# Altium project VESC_BMS.PrjPcb (part 1 of 2)
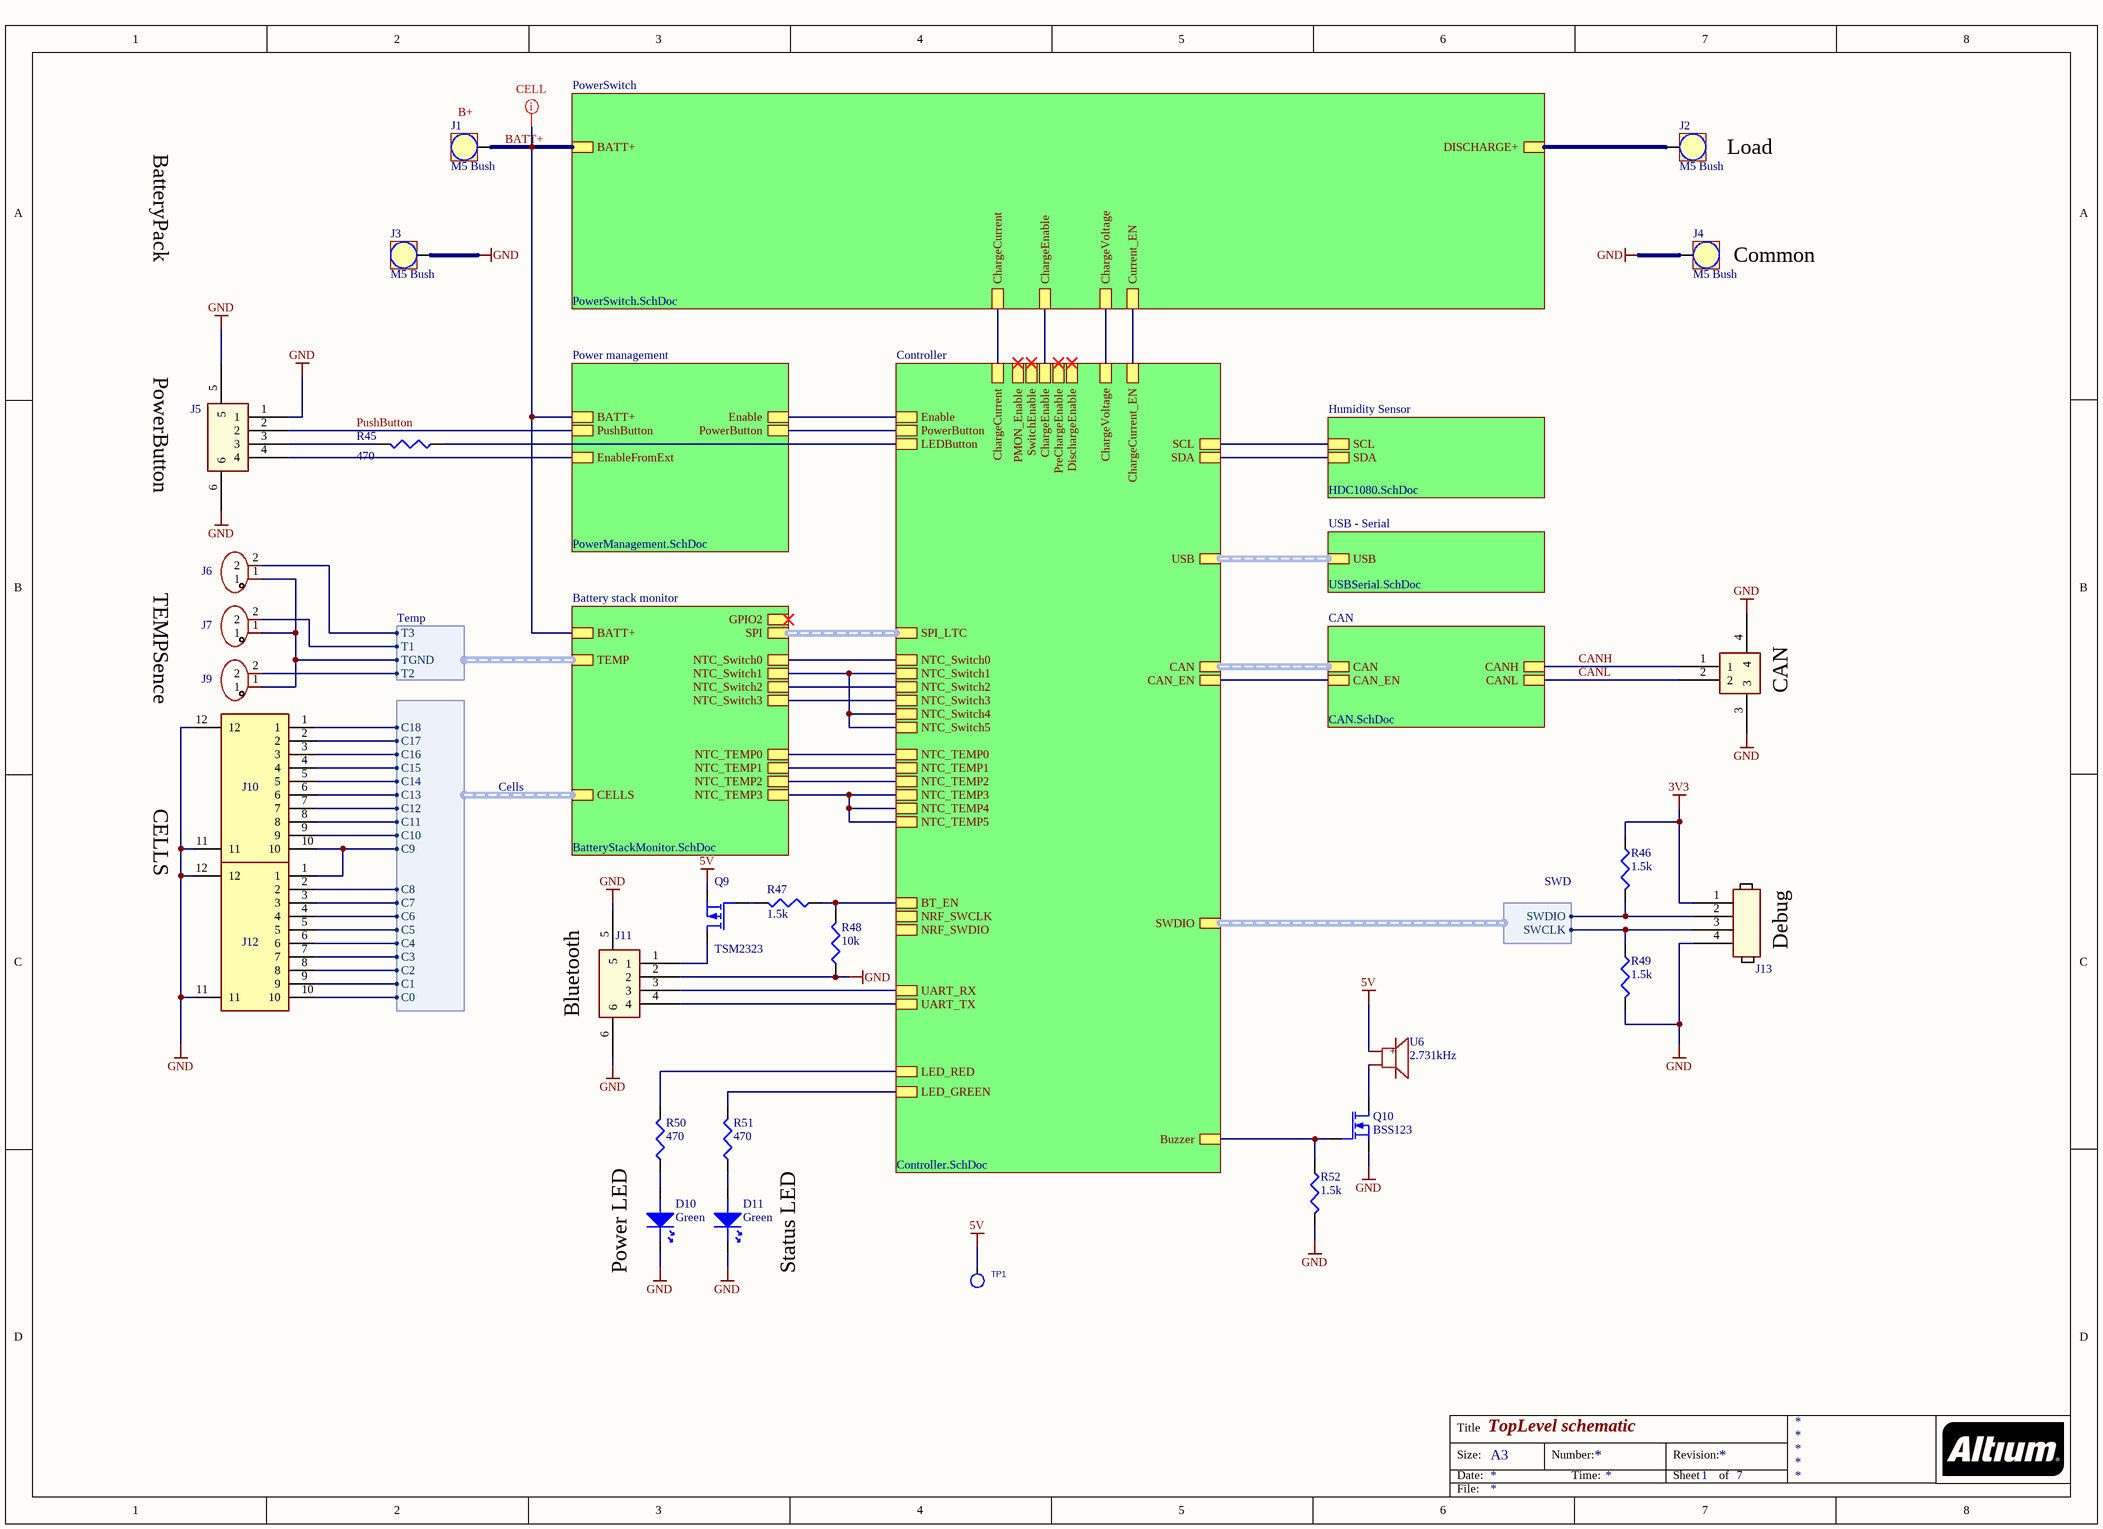
[diagram p0: BMS_TopLevel.SchDoc]
9 sheets, 263 parts. Net scope: hierarchical (ports join the sheet entries above them; power ports are global).
Board file: VESC_BMS.PcbDoc
Sheets:
  BMS_TopLevel.SchDoc
    Battery stack monitor = BatteryStackMonitor.SchDoc
      CELL1 = BMS_CellNode.SchDoc
      CELL2 = BMS_CellNode.SchDoc
      CELL3 = BMS_CellNode.SchDoc
      CELL4 = BMS_CellNode.SchDoc
      CELL5 = BMS_CellNode.SchDoc
      CELL6 = BMS_CellNode.SchDoc
      CELL7 = BMS_CellNode.SchDoc
      CELL8 = BMS_CellNode.SchDoc
      CELL9 = BMS_CellNode.SchDoc
      CELL10 = BMS_CellNode.SchDoc
      CELL11 = BMS_CellNode.SchDoc
      CELL12 = BMS_CellNode.SchDoc
      CELL13 = BMS_CellNode.SchDoc
      CELL14 = BMS_CellNode.SchDoc
      CELL15 = BMS_CellNode.SchDoc
      CELL16 = BMS_CellNode.SchDoc
      CELL17 = BMS_CellNode.SchDoc
      CELL18 = BMS_CellNode.SchDoc
    Controller = Controller.SchDoc
    PowerSwitch = PowerSwitch.SchDoc
    Power management = PowerManagement.SchDoc
    CAN = CAN.SchDoc
    USB - Serial = USBSerial.SchDoc
    Humidity Sensor = HDC1080.SchDoc

## Sheet BMS_TopLevel.SchDoc: TopLevel schematic
size A3; SheetNumber: 1; SheetTotal: 7

### Parts
D10  Green  [LED0603]
D11  Green  [LED0603]
J1  M5 Bush  [CONN-TH_T44001]
J2  M5 Bush  [CONN-TH_T44001]
J3  M5 Bush  [CONN-TH_T44001]
J4  M5 Bush  [CONN-TH_T44001]
J5  1.25-4PWTDK  [SM04B-GHS-TB]  (value not drawn)
J6  WAFER-XH254Z-2A  [CONN-TH_2P-P2.50_XH-2AW]  (value not drawn)
J7  WAFER-XH254Z-2A  [CONN-TH_2P-P2.50_XH-2AW]  (value not drawn)
J8  1.25-2PWTDK  [BM02B-GHS-TBT_1]  (value not drawn)
J9  WAFER-XH254Z-2A  [CONN-TH_2P-P2.50_XH-2AW]  (value not drawn)
J10  S10B-PH-SM4-TB_LF__SN_  [S10B-PH-SM4-TB]  (value not drawn)
J11  1.25-4PWTDK  [SM04B-GHS-TB]  (value not drawn)
J12  S10B-PH-SM4-TB_LF__SN_  [S10B-PH-SM4-TB]  (value not drawn)
J13  4 HEADER  [PZ-4P-2_54]  (value not drawn)
Q9  TSM2323  [SOT-23]
Q10  BSS123  [SOT-23]
R45  470  [0402]
R46  1.5k  [0402]
R47  1.5k  [0402]
R48  10k  [0402]
R49  1.5k  [0402]
R50  470  [0402]
R51  470  [0402]
R52  1.5k  [0402]
TP1  1.3TP  [TP2-1.3MM]  (value not drawn)  (no BOM)
U6  2.731kHz  [BUZ-SMD_4P-L7.5-W7.5-BR]

### Sub-sheets
Battery stack monitor = BatteryStackMonitor.SchDoc: SPI (harness SPI), CELLS (harness Cells), TEMP (harness Temp), BATT+, NTC_Switch0, NTC_Switch1, NTC_Switch2, NTC_Switch3, NTC_TEMP2, NTC_TEMP3, NTC_TEMP0, NTC_TEMP1, GPIO2
CAN = CAN.SchDoc: CANH, CAN (harness CAN), CANL, CAN_EN
Controller = Controller.SchDoc: SPI_LTC (harness SPI), DischargeEnable, ChargeEnable, SwitchEnable, PreChargeEnable, CAN (harness CAN), SWDIO (harness SWD), Buzzer, PMON_Enable, CAN_EN, ChargeCurrent, ChargeVoltage, NTC_Switch0, NTC_Switch1, NTC_Switch2, NTC_Switch3, NTC_Switch4, NTC_Switch5, NTC_TEMP0, NTC_TEMP1, NTC_TEMP2, NTC_TEMP3, NTC_TEMP4, NTC_TEMP5, ChargeCurrent_EN, USB (harness USB), LED_RED, LED_GREEN, UART_TX, UART_RX, NRF_SWCLK, NRF_SWDIO, Enable, PowerButton, LEDButton, SCL, SDA, BT_EN
Humidity Sensor = HDC1080.SchDoc: SCL, SDA
Power management = PowerManagement.SchDoc: PushButton, BATT+, Enable, PowerButton, EnableFromExt
PowerSwitch = PowerSwitch.SchDoc: ChargeEnable, DISCHARGE+, BATT+, ChargeCurrent, ChargeVoltage, Current_EN
USB - Serial = USBSerial.SchDoc: USB (harness USB)

### Harnesses
Cells: C1, C9, C2, C3, C4, C5, C6, C7, C8, C10, C11, C0, C12, C13, C14, C15, C16, C17, C18
Temp: T1, T2, TGND, T3
SWD: SWCLK, SWDIO

### Nets
3V3: J13.1 R46.1
5V: Q9.S TP1.1(TP) U6.1(+)
GND: D10.1 D11.1 J3.1 J4.1 J5.1 J5.5 J5.6 J6.1 J7.1 J8.3 J8.4 J9.1 J10.11 J10.12 J11.2 J11.5 J11.6 J12.11 J12.12 J13.4 Q10.S R48.1 R49.2 R52.2 ; sheet Battery stack monitor/TEMP.TGND
BATT+: J1.1 ; sheet Battery stack monitor/BATT+, sheet PowerSwitch/BATT+, sheet Power management/BATT+
BT_EN: R47.1 R48.2 ; sheet Controller/BT_EN
Buzzer: Q10.G R52.1 ; sheet Controller/Buzzer
CANH: J8.1 ; sheet CAN/CANH
CANL: J8.2 ; sheet CAN/CANL
ChargeEnable: sheet Controller/ChargeEnable, sheet PowerSwitch/ChargeEnable
CN1: J12.10 ; sheet Battery stack monitor/CELLS.C0
CN2: J12.9 ; sheet Battery stack monitor/CELLS.C1
CN3: J12.8 ; sheet Battery stack monitor/CELLS.C2
CN4: J12.7 ; sheet Battery stack monitor/CELLS.C3
CN5: J12.6 ; sheet Battery stack monitor/CELLS.C4
CN6: J12.5 ; sheet Battery stack monitor/CELLS.C5
CN7: J12.4 ; sheet Battery stack monitor/CELLS.C6
CN8: J12.3 ; sheet Battery stack monitor/CELLS.C7
CN9: J12.2 ; sheet Battery stack monitor/CELLS.C8
CN10: J10.10 J12.1 ; sheet Battery stack monitor/CELLS.C9
CN11: J10.9 ; sheet Battery stack monitor/CELLS.C10
CN12: J10.8 ; sheet Battery stack monitor/CELLS.C11
CN13: J10.7 ; sheet Battery stack monitor/CELLS.C12
CN14: J10.6 ; sheet Battery stack monitor/CELLS.C13
CN15: J10.5 ; sheet Battery stack monitor/CELLS.C14
CN16: J10.4 ; sheet Battery stack monitor/CELLS.C15
CN17: J10.3 ; sheet Battery stack monitor/CELLS.C16
CN18: J10.2 ; sheet Battery stack monitor/CELLS.C17
CP18: J10.1 ; sheet Battery stack monitor/CELLS.C18
LED_GREEN: R51.2 ; sheet Controller/LED_GREEN
LED_RED: R50.2 ; sheet Controller/LED_RED
LoadOut: J2.1 ; sheet PowerSwitch/DISCHARGE+
PushButton: J5.2 ; sheet Power management/PushButton
SWCLK: J13.3 R49.1 ; sheet Controller/SWDIO.SWCLK
SWDIO: J13.2 R46.2 ; sheet Controller/SWDIO.SWDIO
NetC6_1: sheet Battery stack monitor/NTC_TEMP1, sheet Controller/NTC_TEMP1
NetC7_1: sheet Battery stack monitor/NTC_TEMP2, sheet Controller/NTC_TEMP2
NetC8_1: sheet Battery stack monitor/NTC_TEMP3, sheet Controller/NTC_TEMP3, sheet Controller/NTC_TEMP4, sheet Controller/NTC_TEMP5
NetC9_1: sheet Battery stack monitor/NTC_TEMP0, sheet Controller/NTC_TEMP0
NetC36_2: sheet Controller/ChargeVoltage, sheet PowerSwitch/ChargeVoltage
NetC37_2: sheet Controller/ChargeCurrent, sheet PowerSwitch/ChargeCurrent
NetD4_2: J5.4 ; sheet Power management/EnableFromExt
NetD10_2: D10.2 R50.1
NetD11_2: D11.2 R51.1
NetJ5_3: J5.3 R45.2
NetJ6_2: J6.2 ; sheet Battery stack monitor/TEMP.T3
NetJ7_2: J7.2 ; sheet Battery stack monitor/TEMP.T1
NetJ9_2: J9.2 ; sheet Battery stack monitor/TEMP.T2
NetJ11_1: J11.1 Q9.D
NetJ11_3: J11.3 ; sheet Controller/UART_RX
NetJ11_4: J11.4 ; sheet Controller/UART_TX
NetQ2_G: sheet Controller/Enable, sheet Power management/Enable
NetQ3_D: sheet Controller/PowerButton, sheet Power management/PowerButton
NetQ9_G: Q9.G R47.2
NetQ10_D: Q10.D U6.2
NetR8_2: sheet Battery stack monitor/NTC_Switch0, sheet Controller/NTC_Switch0
NetR10_2: sheet Battery stack monitor/NTC_Switch1, sheet Controller/NTC_Switch1, sheet Controller/NTC_Switch4, sheet Controller/NTC_Switch5
NetR12_2: sheet Battery stack monitor/NTC_Switch2, sheet Controller/NTC_Switch2
NetR14_2: sheet Battery stack monitor/NTC_Switch3, sheet Controller/NTC_Switch3
NetR42_2: sheet Controller/ChargeCurrent_EN, sheet PowerSwitch/Current_EN
NetR45_1: R45.1 ; sheet Controller/LEDButton
NetR61_1: sheet Controller/SDA, sheet Humidity Sensor/SDA
NetR62_1: sheet Controller/SCL, sheet Humidity Sensor/SCL
NetU2_56: sheet Controller/CAN_EN, sheet CAN/CAN_EN

Not connected (* = marked no-connect by the designer): U6 3 4

### Buses and harness runs
harness sheet Battery stack monitor/SPI = sheet Controller/SPI_LTC
harness sheet CAN/CAN = sheet Controller/CAN
harness sheet Controller/USB = sheet USB - Serial/USB

### Layout directives
net class CELL: BATT+

### Notes on the sheet
- BatteryPack
- (near J2) Load
- (near J4) Common
- (near J5) PowerButton
- TEMPSence
- (near J8) CAN
- CELLS
- (near J11) Bluetooth
- (near J13) Debug
- Power LED
- Status LED
- Labels drawn without touching a wire or pin: B+
- Title
- Size:
- Date:
- A3
- Number:
- Time:
- Revision:
- Sheet
- of
- File:

### Library data of the parts
D10 D11 = KP-2012SGC: Led, Green, Li:12mcd, Vf:2.2V, If:0.02A; Brand: KingBright; Case Style: 0805; Forward Current: 0.02A; Forward Voltage: 2.2V; Luminous Intensity: 12mcd; Brand Number: KP-2012SGC; Order Code Supplier: 1318243; Price: 0,06; Supplier: Farnell; Temperature Range: -30°C to +85°C
J1-J4 = T44001: Bush with Circumference M4; Brand: Wurth; Brand Number: 7460408; Case Style: M5Bush; Order Code Supplier: 1821279; Price: 4,17; Supplier: Farnell
J6 J7 J9 = WAFER-XH254Z-2A: Manufacturer: HANBO(汉博); Add into BOM: yes; Pins Structure: 1x2P; Pitch: 2.54mm; Reference Series: XH; Number of PINs Per Row: 2; Current Rating (Max): 3A; Symbol: WAFER-XH254Z-2A; Device: WAFER-XH254Z-2A; LCSC Part Name: WAFER-XH254Z-2A; Supplier Part: C7432682; Manufacturer Part: WAFER-XH254Z-2A; Supplier Footprint: 插件,P=2.5mm; Datasheet: https://atta.szlcsc.com/upload/public/pdf/source/20230718/3B4FABA5D38EFB02DAF74E7C2B33D98F.pdf; Supplier: LCSC; Convert to PCB: yes; Mounting Style: 直插; Number of Pins: 2P; Number of Rows: 1; Operating Temperature Range: -25℃~+85℃
J10 J12 = S10B-PH-SM4-TB_LF__SN_: Connector; Manufacturer_Name: JST (JAPAN SOLDERLESS TERMINALS); Manufacturer_Part_Number: S10B-PH-SM4-TB(LF)(SN); Datasheet Link: http://uk.rs-online.com/web/p/products/6881350; Mouser Part Number: 306-S10BPHSM4TBLFSN; Mouser Price/Stock: https://www.mouser.co.uk/ProductDetail/JST-Commercial/S10B-PH-SM4-TBLFSN?qs=QpmGXVUTftH7ZRPAPdrNVw%3D%3D; Arrow Part Number: S10B-PH-SM4-TB(LF)(SN); Arrow Price/Stock: https://www.arrow.com/en/products/s10b-ph-sm4-tb-lf-sn/jst-manufacturing?region=nac
Q9 = TSM2323: Mosfet, P-channel, Vds:20V, Id:4.7A, Vgs-th:1V, Rds-on:0.039ohm; Brand: Taiwan Semiconductor; Brand Number: TSM2323CX; Drain Current: 4.7A; Drain Source Voltage: 20V; Gate Source Voltage: 8V; Threshold Voltage: 1V; Case Style: SOT-23; On Resistance: 0.039ohm; Order Code Supplier: 1864590; Price: 0,195; Supplier: Farnell; Temperature Range: -55°C to +150°C; Transistor Polarity: P-channel
Q10 = BSS123: Mosfet, N-channel, Vds:100V, Id:0.15A, Vgs-th:2.8V, Rds-on:3.5ohm; Brand: NXP; Drain Current: 0.15A; Drain Source Voltage: 100V; Gate Source Voltage: 20V; On Resistance: 3.5ohm; Threshold Voltage: 2.8V; Brand Number: BSS123; Case Style: SOT-23; Order Code Supplier: 1510764; Price: 0,082; Supplier: Farnell; Temperature Range: -55°C to +150°C; Transistor Polarity: N-channel
R45 R50 R51 = 470/0402/0063W/50V: Resistor, 470, 1%, 0.0625W, 50V, 100PPM, 0402; Brand: VISHAY DRALORIC; Brand Number: CRG0402F470R; Power Rating: 0.063W; Case Style: 0402; Order Code Supplier: 2331533; Price: 0,0099; Resistance: 470; Supplier: Farnell; Temperature Coefficient: ± 100PPM; Temperature Range: -55°C to +125°C; Voltage Rating: 50V
R46-R49 R52 = 1.5k/0402/0063W/50V: Resistor, 1.5k, 0.1%, 0.0625W, 50V, 100PPM, 0402; Brand: VISHAY DRALORIC; Brand Number: CRCW04021K50FKED; Power Rating: 0.063W; Case Style: 0402; Order Code Supplier: 2121624; Price: 0,0054; Resistance: 1.5k; Supplier: Farnell; Temperature Coefficient: ± 100PPM; Temperature Range: -55°C to +125°C; Voltage Rating: 50V
TP1 = TESTPT4: 1.3mm
U6 = HYG-7525A: Manufacturer: HYDZ(华宇); Add into BOM: yes; Current Consumption: 90mA; Sound Pressure Level(SPL): 85dB; Symbol: HYG-7525A; Device: HYG-7525A; LCSC Part Name: 贴片无源蜂鸣器; Supplier Part: C7544812; Manufacturer Part: HYG-7525A; Supplier Footprint: SMD,7.5x7.5mm; JLCPCB Part Class: 扩展库; Datasheet: https://atta.szlcsc.com/upload/public/pdf/source/20230825/78098EC44B170663F3151CF5366FAD5D.pdf; Supplier: LCSC; Convert to PCB: yes; Value: 2.731kHz

## Sheet BatteryStackMonitor.SchDoc: Battery stack monitor
size A3; SheetNumber: 2; SheetTotal: 7
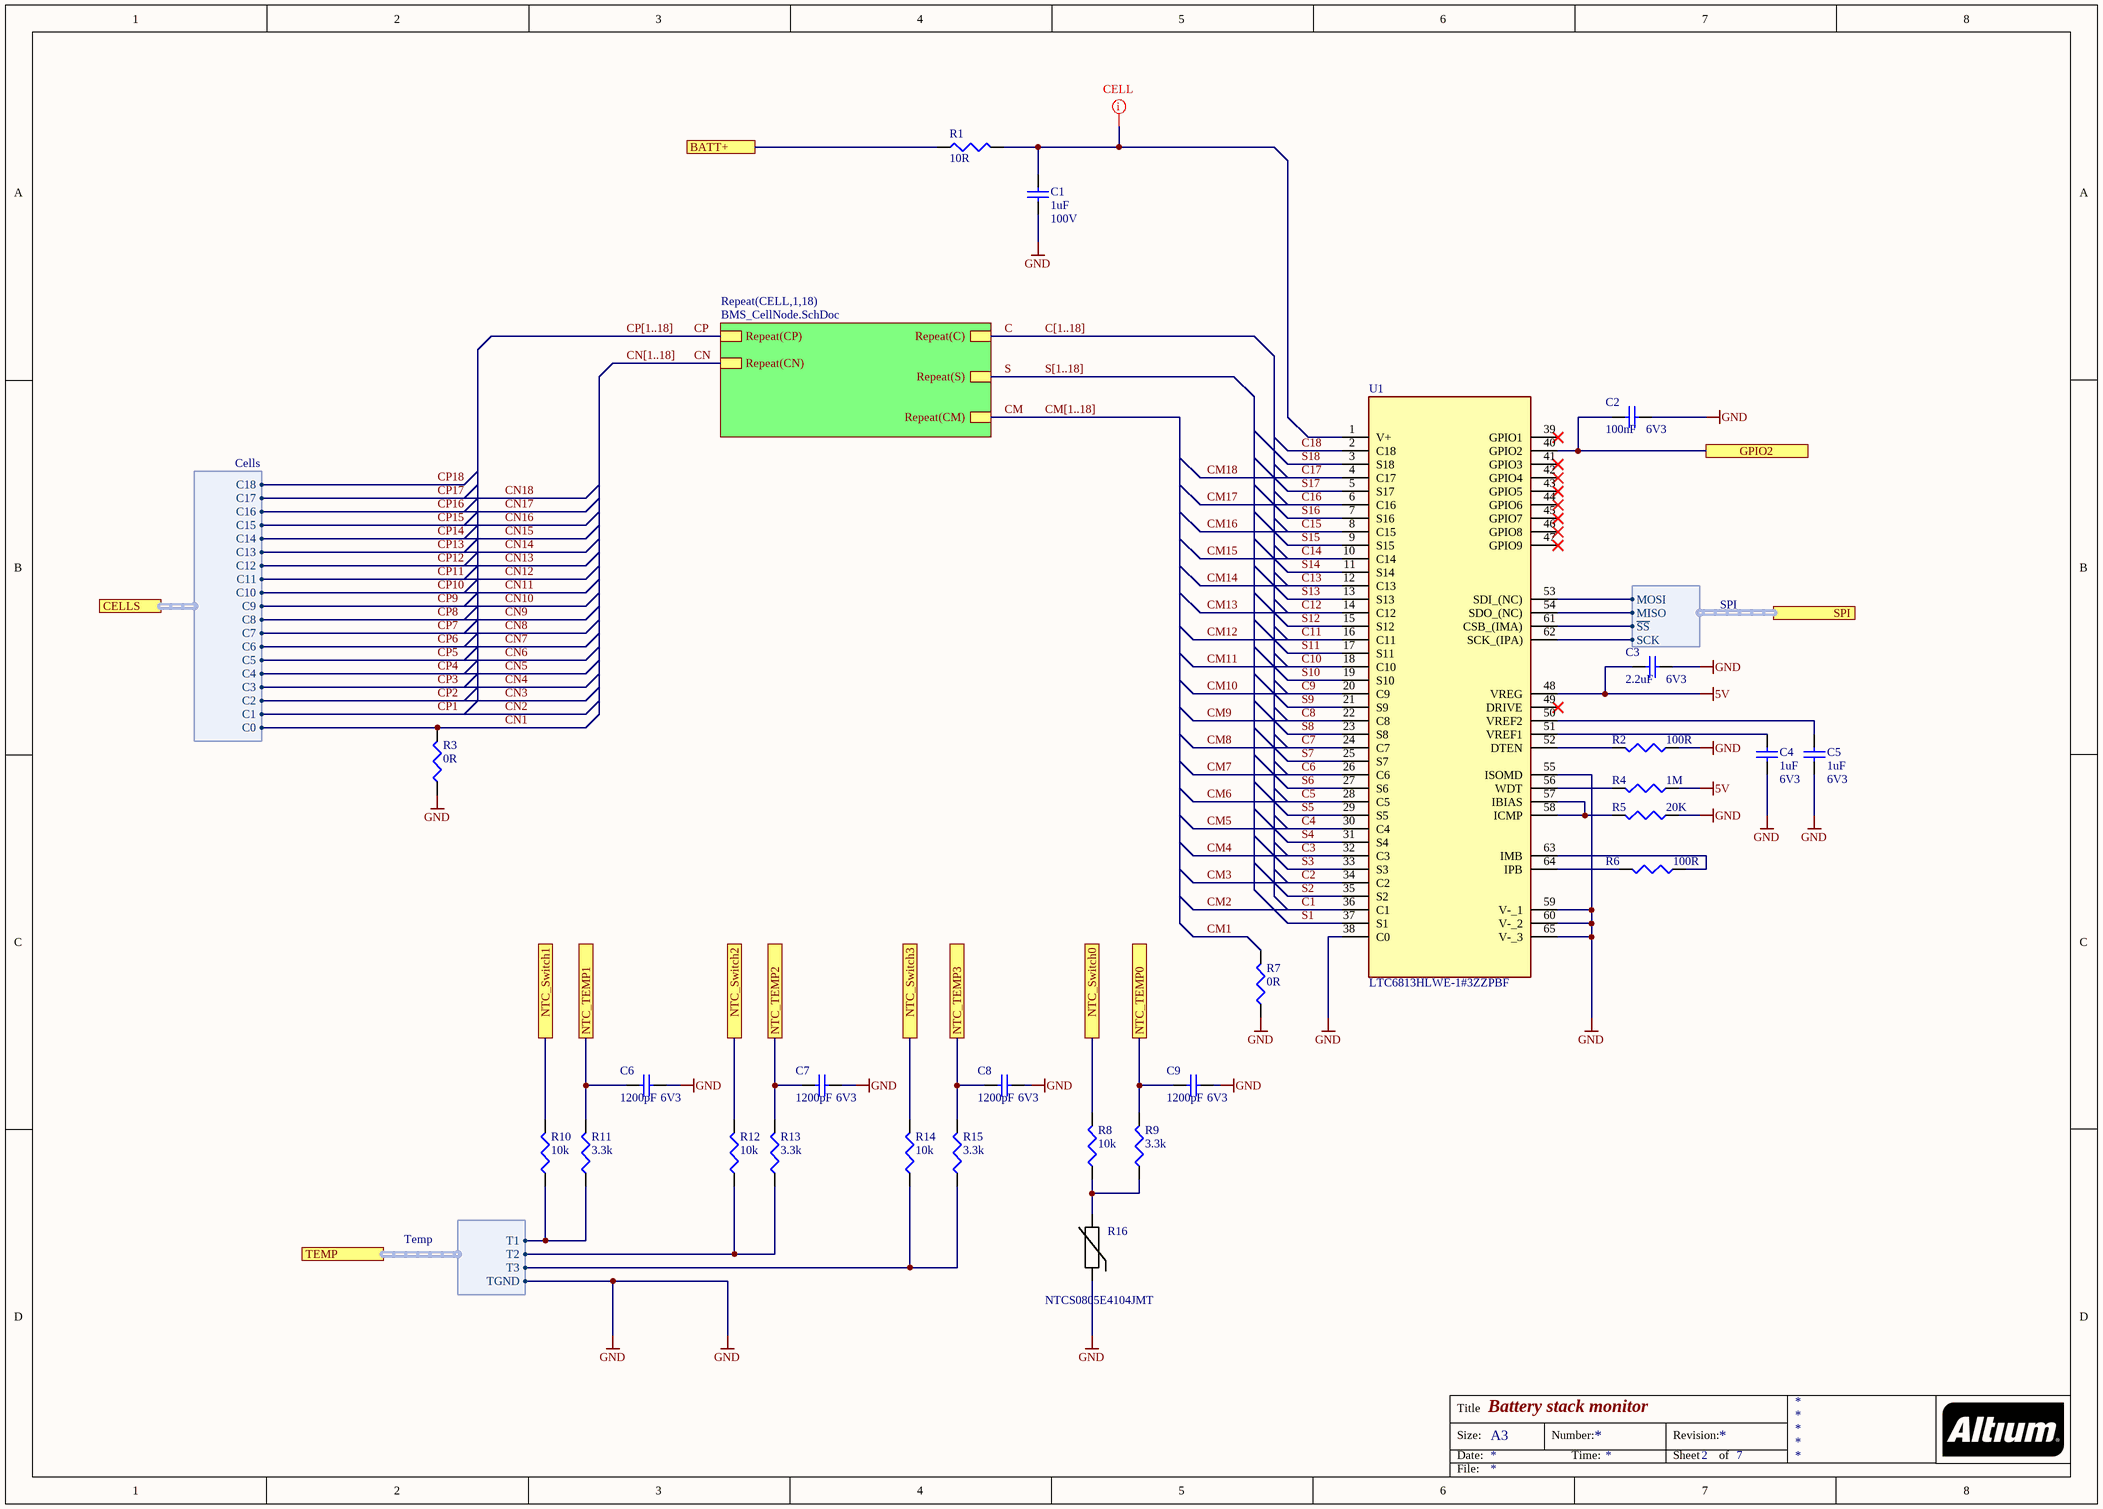
[diagram p1: BatteryStackMonitor.SchDoc]

### Parts
C1  1uF  Voltage Rating: 100V  [C-1206]
C2  100nF  Voltage Rating: 6V3  [C0402]
C3  2.2uF  Voltage Rating: 6V3  [C0402]
C4  1uF  Voltage Rating: 6V3  [C0402]
C5  1uF  Voltage Rating: 6V3  [C0402]
C6  1200pF  Voltage Rating: 6V3  [C0402]
C7  1200pF  Voltage Rating: 6V3  [C0402]
C8  1200pF  Voltage Rating: 6V3  [C0402]
C9  1200pF  Voltage Rating: 6V3  [C0402]
R1  10R  [R1206]
R2  100R  [0402]
R3  0R  [0603]
R4  1M  [0402]
R5  20K  [0402]
R6  100R  [0402]
R7  0R  [0603]
R8  10k  [0402]
R9  3.3k  [0402]
R10  10k  [0402]
R11  3.3k  [0402]
R12  10k  [0402]
R13  3.3k  [0402]
R14  10k  [0402]
R15  3.3k  [0402]
R16  NTCS0805E4104JMT  [0603]
U1  LTC6813HLWE-1#3ZZPBF  [QFP50P1200X1200X160-65N]

### Sub-sheets
Repeat(CELL,1,18) = BMS_CellNode.SchDoc: Repeat(CN), Repeat(CP), Repeat(S), Repeat(C), Repeat(CM)

### Ports
BATT+, CELLS (harness Cells), GPIO2, NTC_Switch0, NTC_Switch1, NTC_Switch2, NTC_Switch3, NTC_TEMP0, NTC_TEMP1, NTC_TEMP2, NTC_TEMP3, SPI (harness SPI), TEMP (harness Temp)

### Harnesses
SPI: ~{SS}, SCK, MISO, MOSI
Cells: C1, C9, C2, C3, C4, C5, C6, C7, C8, C10, C11, C0, C12, C13, C14, C15, C16, C17, C18
Temp: T1, T2, TGND, T3

### Nets
5V: C3.1 R4.1 U1.48(VREG)
GND: C1.1 C2.2 C3.2 C4.2 C5.2 C6.2 C7.2 C8.2 C9.2 R2.1 R3.1 R5.1 R7.1 R16.1 U1.38(C0) U1.55(ISOMD) U1.59(V-_1) U1.60(V-_2) U1.65(V-_3) ; port TEMP.TGND
BATT+: R1.1 ; port BATT+
C: sheet Repeat(CELL,1,18)/Repeat(C)
C1: U1.36(C1)  [also labelled CM2]
C2: U1.34(C2)  [also labelled CM3]
C3: U1.32(C3)  [also labelled CM4]
C4: U1.30(C4)  [also labelled CM5]
C5: U1.28(C5)  [also labelled CM6]
C6: U1.26(C6)  [also labelled CM7]
C7: U1.24(C7)  [also labelled CM8]
C8: U1.22(C8)  [also labelled CM9]
C9: U1.20(C9)  [also labelled CM10]
C10: U1.18(C10)  [also labelled CM11]
C11: U1.16(C11)  [also labelled CM12]
C12: U1.14(C12)  [also labelled CM13]
C13: U1.12(C13)  [also labelled CM14]
C14: U1.10(C14)  [also labelled CM15]
C15: U1.8(C15)  [also labelled CM16]
C16: U1.6(C16)  [also labelled CM17]
C17: U1.4(C17)  [also labelled CM18]
C18: U1.2(C18)
CM: sheet Repeat(CELL,1,18)/Repeat(CM)
CM1: R7.2
CN: sheet Repeat(CELL,1,18)/Repeat(CN)
CN1: R3.2 ; port CELLS.C0
CP: sheet Repeat(CELL,1,18)/Repeat(CP)
MISO: U1.54(SDO_(NC)) ; port SPI.MISO
MOSI: U1.53(SDI_(NC)) ; port SPI.MOSI
S: sheet Repeat(CELL,1,18)/Repeat(S)
S1: U1.37(S1)
S2: U1.35(S2)
S3: U1.33(S3)
S4: U1.31(S4)
S5: U1.29(S5)
S6: U1.27(S6)
S7: U1.25(S7)
S8: U1.23(S8)
S9: U1.21(S9)
S10: U1.19(S10)
S11: U1.17(S11)
S12: U1.15(S12)
S13: U1.13(S13)
S14: U1.11(S14)
S15: U1.9(S15)
S16: U1.7(S16)
S17: U1.5(S17)
S18: U1.3(S18)
~{SS}: U1.61(CSB_(IMA)) ; port SPI.~{SS}
SCK: U1.62(SCK_(IPA)) ; port SPI.SCK
NetC1_2: C1.2 R1.2 U1.1(V+)
NetC2_1: C2.1 U1.40(GPIO2) ; port GPIO2
NetC4_1: C4.1 U1.51(VREF1)
NetC5_1: C5.1 U1.50(VREF2)
NetC6_1: C6.1 R11.2 ; port NTC_TEMP1
NetC7_1: C7.1 R13.2 ; port NTC_TEMP2
NetC8_1: C8.1 R15.2 ; port NTC_TEMP3
NetC9_1: C9.1 R9.2 ; port NTC_TEMP0
NetJ6_2: R14.1 R15.1 ; port TEMP.T3
NetJ7_2: R10.1 R11.1 ; port TEMP.T1
NetJ9_2: R12.1 R13.1 ; port TEMP.T2
NetR2_2: R2.2 U1.52(DTEN)
NetR4_2: R4.2 U1.56(WDT)
NetR5_2: R5.2 U1.57(IBIAS) U1.58(ICMP)
NetR6_1: R6.1 U1.63(IMB)
NetR6_2: R6.2 U1.64(IPB)
NetR8_1: R8.1 R9.1 R16.2
NetR8_2: R8.2 ; port NTC_Switch0
NetR10_2: R10.2 ; port NTC_Switch1
NetR12_2: R12.2 ; port NTC_Switch2
NetR14_2: R14.2 ; port NTC_Switch3

Not connected (* = marked no-connect by the designer): U1 39(GPIO1)* 41(GPIO3)* 42(GPIO4)* 43(GPIO5)* 44(GPIO6)* 45(GPIO7)* 46(GPIO8)* 47(GPIO9)* 49(DRIVE)*

### Buses and harness runs
bus C[1..18]
bus CM[1..18]
bus CN[1..18]
bus CP[1..18]
bus S[1..18]

### Layout directives
net class CELL: NetC1_2

### Notes on the sheet
- Title
- Size:
- Date:
- A3
- Number:
- Time:
- Revision:
- Sheet
- of
- File:

### Library data of the parts
C1 = 1uF/1206/CER/100V: Capacitor, 1uF, 100V, X7R; Capacitance Tolerance: ± 10%; Capacitor Case Style: 1206; Brand Number: 12061C105K4Z2A; Brand: AVX; Dielectric Characteristic: X7R; Capacitance: 1uF; Temperature Range: -55°C to +125°C; Price: 0,52; Order Code Supplier: 1833855; Supplier: Farnell
C2-C9 = 1uF/0402/CER/6.3V: Capacitor, 1uF, 6.3V, X5R; Capacitance Tolerance: ± 10%; Capacitor Case Style: 0402; Brand Number: 04026D105KAT2A; Brand: AVX; Dielectric Characteristic: X5R; Capacitance: 1uF; Temperature Range: -55°C to +85°C; Price: 0,0874; Order Code Supplier: 1327658; Supplier: Farnell
R1 = RQ73C2B10RBTDF: Resistor; Manufacturer_Name: TE Connectivity; Datasheet Link: https://www.te.com/commerce/DocumentDelivery/DDEController?Action=showdoc&DocId=Data+Sheet%7F1773270-2%7FB%7Fpdf%7FEnglish%7FENG_DS_1773270-2_B.pdf%7F2176383-1; Height: 0.65mm; Manufacturer_Part_Number: RQ73C2B10RBTDF
R2 R4-R6 = 1M/0402/0063W/50V: Resistor, 1M, 0.1%, 0.0625W, 50V, 100PPM, 0402; Brand: VISHAY DRALORIC; Brand Number: CRCW04021M00FKED; Power Rating: 0.063W; Case Style: 0402; Order Code Supplier: 2121984; Price: 0,0006; Resistance: 1M; Supplier: Farnell; Temperature Coefficient: ± 100PPM; Temperature Range: -55°C to +125°C; Voltage Rating: 50V
R3 R7 = 0/0603/0063W/50V: Resistor, 0R, 0.1%, 0.063W, 50V, 200PPM, 0603; Brand: VISHAY DRALORIC; Brand Number: CRCW06030000Z0EA; Case Style: 0603; Order Code Supplier: 2122112; Power Rating: 0.063W; Price: 0,043; Resistance: 0R; Supplier: Farnell; Temperature Coefficient: ± 200PPM; Temperature Range: -55°C to +125°C; Voltage Rating: 50V
R8-R15 = 10k/0402/0063W/50V: Resistor, 10k, 0.1%, 0.0625W, 50V, 100PPM, 0402; Brand: VISHAY DRALORIC; Brand Number: CRCW040210K0FKED; Power Rating: 0.063W; Case Style: 0402; Order Code Supplier: 2121730; Price: 0,0005; Resistance: 10k; Supplier: Farnell; Temperature Coefficient: ± 100PPM; Temperature Range: -55°C to +125°C; Voltage Rating: 50V
R16 = NTCS0805E4104JMT: THERMISTOR, NTC, 100K, 5%; Case Style: 0805; Brand: VISHAY; Supplier: Farnell; Price: 0,65; Order Code Supplier: 1187095; Brand Number: NTCS0805E4104JMT
U1 = LTC6813HLWE-1#3ZZPBF: Integrated Circuit; Manufacturer_Name: Analog Devices; Datasheet Link: https://www.analog.com/media/en/technical-documentation/data-sheets/LTC6813-1.pdf; Height: 1.6mm; Manufacturer_Part_Number: LTC6813HLWE-1#3ZZPBF; Mouser Part Number: 584-6813HLWE13ZZPBF; Mouser Price/Stock: https://www.mouser.co.uk/ProductDetail/Analog-Devices-Linear-Technology/LTC6813HLWE-13ZZPBF?qs=lYGu3FyN48e3Qu9IYnRGuQ%3D%3D; Arrow Part Number: LTC6813HLWE-1#3ZZPBF; Arrow Price/Stock: https://www.arrow.com/en/products/ltc6813hlwe-13zzpbf/linear-technology

## Sheet BMS_CellNode.SchDoc
size A4
Used 18 times, as channels Battery stack monitor/CELL1, Battery stack monitor/CELL2, Battery stack monitor/CELL3, Battery stack monitor/CELL4, Battery stack monitor/CELL5, Battery stack monitor/CELL6, Battery stack monitor/CELL7, Battery stack monitor/CELL8, Battery stack monitor/CELL9, Battery stack monitor/CELL10, Battery stack monitor/CELL11, Battery stack monitor/CELL12, Battery stack monitor/CELL13, Battery stack monitor/CELL14, Battery stack monitor/CELL15, Battery stack monitor/CELL16, Battery stack monitor/CELL17, Battery stack monitor/CELL18. Parts and nets are listed once, with the designators drawn on the sheet.
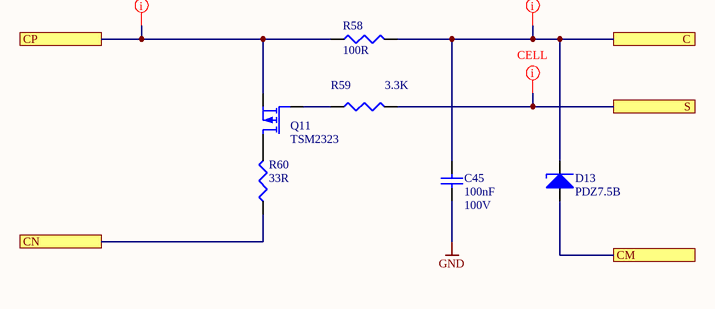
[diagram p2: BMS_CellNode.SchDoc]

### Parts
C45  100nF  Voltage Rating: 100V  [C-0805]
D13  PDZ7.5B  [SOD-323]
Q11  TSM2323  [SOT-23]
R58  100R  [0603]
R59  3.3K  [0603]
R60  33R  [2512]

### Ports
C, CM, CN, CP, S

### Nets
GND: C45.1
C: C45.2 D13.2 R58.2 ; port C
CM: D13.1 ; port CM
CN: R60.1 ; port CN
CP: Q11.S R58.1 ; port CP
S: R59.2 ; port S
NetQ11_D: Q11.D R60.2
NetQ11_G: Q11.G R59.1

### Channels
Battery stack monitor/CELL1: designators end in _CELL1; ports C=C1 CM=CM1 CN=CN1 CP=CN2 S=S1
Battery stack monitor/CELL2: designators end in _CELL2; ports C=C2 CM=C1 CN=CN2 CP=CN3 S=S2
Battery stack monitor/CELL3: designators end in _CELL3; ports C=C3 CM=C2 CN=CN3 CP=CN4 S=S3
Battery stack monitor/CELL4: designators end in _CELL4; ports C=C4 CM=C3 CN=CN4 CP=CN5 S=S4
Battery stack monitor/CELL5: designators end in _CELL5; ports C=C5 CM=C4 CN=CN5 CP=CN6 S=S5
Battery stack monitor/CELL6: designators end in _CELL6; ports C=C6 CM=C5 CN=CN6 CP=CN7 S=S6
Battery stack monitor/CELL7: designators end in _CELL7; ports C=C7 CM=C6 CN=CN7 CP=CN8 S=S7
Battery stack monitor/CELL8: designators end in _CELL8; ports C=C8 CM=C7 CN=CN8 CP=CN9 S=S8
Battery stack monitor/CELL9: designators end in _CELL9; ports C=C9 CM=C8 CN=CN9 CP=CN10 S=S9
Battery stack monitor/CELL10: designators end in _CELL10; ports C=C10 CM=C9 CN=CN10 CP=CN11 S=S10
Battery stack monitor/CELL11: designators end in _CELL11; ports C=C11 CM=C10 CN=CN11 CP=CN12 S=S11
Battery stack monitor/CELL12: designators end in _CELL12; ports C=C12 CM=C11 CN=CN12 CP=CN13 S=S12
Battery stack monitor/CELL13: designators end in _CELL13; ports C=C13 CM=C12 CN=CN13 CP=CN14 S=S13
Battery stack monitor/CELL14: designators end in _CELL14; ports C=C14 CM=C13 CN=CN14 CP=CN15 S=S14
Battery stack monitor/CELL15: designators end in _CELL15; ports C=C15 CM=C14 CN=CN15 CP=CN16 S=S15
Battery stack monitor/CELL16: designators end in _CELL16; ports C=C16 CM=C15 CN=CN16 CP=CN17 S=S16
Battery stack monitor/CELL17: designators end in _CELL17; ports C=C17 CM=C16 CN=CN17 CP=CN18 S=S17
Battery stack monitor/CELL18: designators end in _CELL18; ports C=C18 CM=C17 CN=CN18 CP=CP18 S=S18

### Layout directives
net class CELL: C1, CN2, S1

### Library data of the parts
C45 = 100nF/0805/CER/100V: Capacitor, 100nF, 100V, X7R; Capacitance Tolerance: ± 10%; Capacitor Case Style: 0805; Brand Number: C0805C104K1RACTU; Brand: KEMET; Dielectric Characteristic: X7R; Capacitance: 100nF; Temperature Range: -55°C to +125°C; Price: 0,096; Order Code Supplier: 1650862; Supplier: Farnell
D13 = PDZ7.5B: Diode, Vrrm: 7.5V, If: 0.2A, Vf: 0.9V; Brand: NXP; Brand Number: PDZ7.5B,115; Case Style: SOD-323; Forward Current: 0.2A; Forward Voltage: 0.9V; Order Code Supplier: 2319197; Price: 0,263; Supplier: Farnell; Temperature Range: -65°C to +150°C; Zener Voltage: 7.5V
Q11 = TSM2323: as Q9 on sheet BMS_TopLevel; Case Style: SOT-23; On Resistance: 0.039ohm; Order Code Supplier: 1864590; Price: 0,195; Supplier: Farnell; Temperature Range: -55°C to +150°C; Transistor Polarity: P-channel
R58 = 100/0603/0063W/50V: Resistor, 100R, 1%, 0.063W, 50V, 200PPM, 0603; Brand: VISHAY DRALORIC; Brand Number: CRCW0603100RFKEA; Case Style: 0603; Order Code Supplier: 2122239; Power Rating: 0.063W; Price: 0,007; Resistance: 100R; Supplier: Farnell; Temperature Coefficient: ± 200PPM; Temperature Range: -55°C to +125°C; Voltage Rating: 50V
R59 = 3.3K/0603/0125W/50V: Resistor, 3.3K, 1%, 0.125W, 50V, 100PPM, 0603; Brand: MULTICOMP; Brand Number: MCHP03W8F3301T5E; Case Style: 0603; Order Code Supplier: 1576291; Power Rating: 0.125W; Price: 0,08; Resistance: 3.3K; Supplier: Farnell; Temperature Coefficient: ± 100PPM; Temperature Range: -55°C to +155°C; Voltage Rating: 50V
R60 = 15/2512/2W/250V: Resistor, 15R, 1%, 2W, 200V, 200PPM, 2512; Brand: TE CONNECTIVITY / CGS; Brand Number: 352115RFT; Voltage Rating: 250V; Case Style: 2512; Order Code Supplier: 2117454; Power Rating: 2W; Price: 0,30; Resistance: 15R; Supplier: Farnell; Temperature Coefficient: ± 200PPM; Temperature Range: -55°C to +125°C

## Sheet Controller.SchDoc: Controller
size A3; SheetNumber: 3; SheetTotal: 7
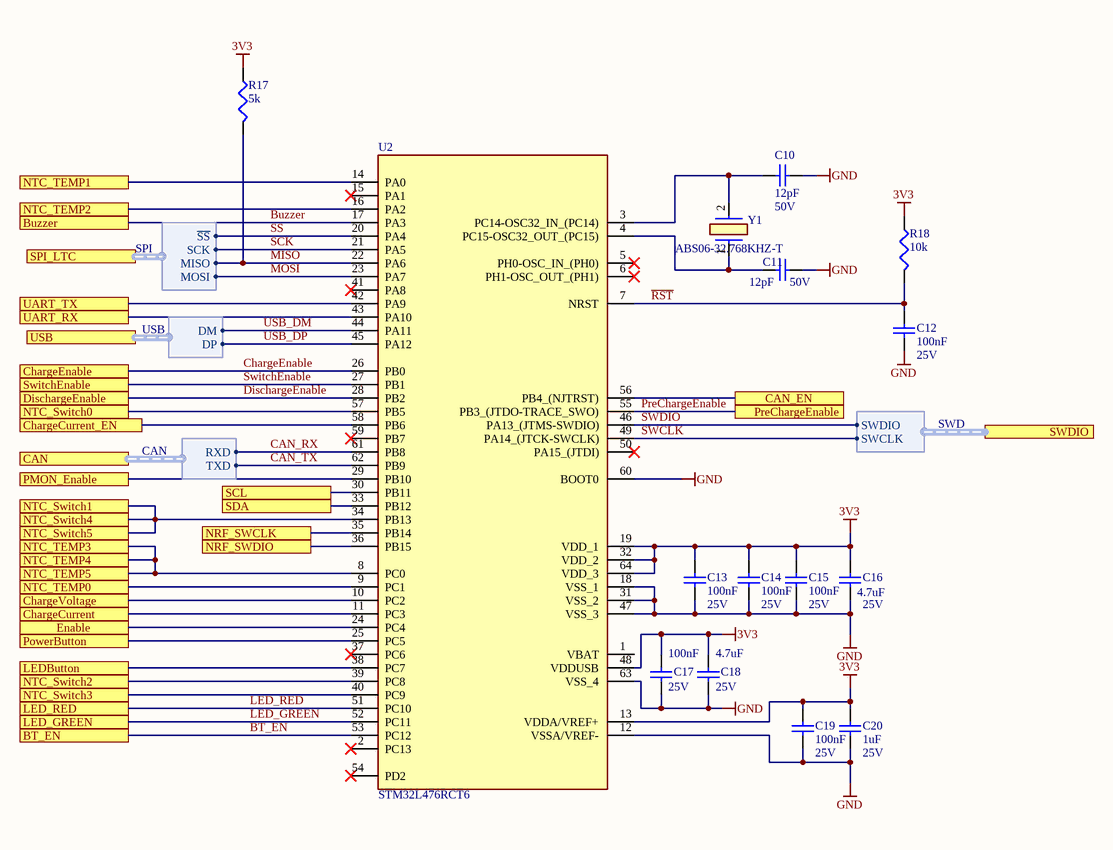
[diagram p3: Controller.SchDoc]

### Parts
C10  12pF  Voltage Rating: 50V  [C0402]
C11  12pF  Voltage Rating: 50V  [C0402]
C12  100nF  Voltage Rating: 25V  [C0402]
C13  100nF  Voltage Rating: 25V  [C0402]
C14  100nF  Voltage Rating: 25V  [C0402]
C15  100nF  Voltage Rating: 25V  [C0402]
C16  4.7uF  Voltage Rating: 25V  [C0402]
C17  100nF  Voltage Rating: 25V  [C0402]
C18  4.7uF  Voltage Rating: 25V  [C0402]
C19  100nF  Voltage Rating: 25V  [C0402]
C20  1uF  Voltage Rating: 25V  [C0402]
R17  5k  [0402]
R18  10k  [0402]
U2  STM32L476RCT6  [QFP50P1200X1200X160-64N]
Y1  ABS06-32.768KHZ-T  [OSC-SMD_L2.0-W1.2]

### Ports
BT_EN, Buzzer, CAN (harness CAN), CAN_EN, ChargeCurrent, ChargeCurrent_EN, ChargeEnable, ChargeVoltage, DischargeEnable, Enable, LED_GREEN, LED_RED, LEDButton, NRF_SWCLK, NRF_SWDIO, NTC_Switch0, NTC_Switch1, NTC_Switch2, NTC_Switch3, NTC_Switch4, NTC_Switch5, NTC_TEMP0, NTC_TEMP1, NTC_TEMP2, NTC_TEMP3, NTC_TEMP4, NTC_TEMP5, PMON_Enable, PowerButton, PreChargeEnable, SCL, SDA, SPI_LTC (harness SPI), SWDIO (harness SWD), SwitchEnable, UART_RX, UART_TX, USB (harness USB)

### Harnesses
USB: DM, DP
CAN: RXD, TXD
SPI: ~{SS}, SCK, MISO, MOSI
SWD: SWCLK, SWDIO

### Nets
3V3: C13.2 C14.2 C15.2 C16.2 C17.2 C18.2 C19.2 C20.2 R17.2 R18.2 U2.13(VDDA/VREF+) U2.19(VDD_1) U2.32(VDD_2) U2.48(VDDUSB) U2.64(VDD_3)
GND: C10.1 C11.1 C12.1 C13.1 C14.1 C15.1 C16.1 C17.1 C18.1 C19.1 C20.1 U2.12(VSSA/VREF-) U2.18(VSS_1) U2.31(VSS_2) U2.47(VSS_3) U2.60(BOOT0) U2.63(VSS_4)
BT_EN: U2.53(PC12) ; port BT_EN
Buzzer: U2.17(PA3) ; port Buzzer
CAN_RX: U2.61(PB8) ; port CAN.RXD
CAN_TX: U2.62(PB9) ; port CAN.TXD
ChargeEnable: U2.26(PB0) ; port ChargeEnable
DischargeEnable: U2.28(PB2) ; port DischargeEnable
LED_GREEN: U2.52(PC11) ; port LED_GREEN
LED_RED: U2.51(PC10) ; port LED_RED
MISO: R17.1 U2.22(PA6) ; port SPI_LTC.MISO
MOSI: U2.23(PA7) ; port SPI_LTC.MOSI
PreChargeEnable: U2.55(PB3_(JTDO-TRACE_SWO)) ; port PreChargeEnable
~{RST}: C12.2 R18.1 U2.7(NRST)
~{SS}: U2.20(PA4) ; port SPI_LTC.~{SS}
SCK: U2.21(PA5) ; port SPI_LTC.SCK
SWCLK: U2.49(PA14_(JTCK-SWCLK)) ; port SWDIO.SWCLK
SWDIO: U2.46(PA13_(JTMS-SWDIO)) ; port SWDIO.SWDIO
SwitchEnable: U2.27(PB1) ; port SwitchEnable
USB_DM: U2.44(PA11) ; port USB.DM
USB_DP: U2.45(PA12) ; port USB.DP
NetC6_1: U2.14(PA0) ; port NTC_TEMP1
NetC7_1: U2.16(PA2) ; port NTC_TEMP2
NetC8_1: U2.8(PC0) ; port NTC_TEMP3, port NTC_TEMP4, port NTC_TEMP5
NetC9_1: U2.9(PC1) ; port NTC_TEMP0
NetC10_2: C10.2 U2.3(PC14-OSC32_IN_(PC14)) Y1.2
NetC11_2: C11.2 U2.4(PC15-OSC32_OUT_(PC15)) Y1.1
NetC36_2: U2.10(PC2) ; port ChargeVoltage
NetC37_2: U2.11(PC3) ; port ChargeCurrent
NetJ11_3: U2.43(PA10) ; port UART_RX
NetJ11_4: U2.42(PA9) ; port UART_TX
NetQ2_G: U2.24(PC4) ; port Enable
NetQ3_D: U2.25(PC5) ; port PowerButton
NetR8_2: U2.57(PB5) ; port NTC_Switch0
NetR10_2: U2.34(PB13) ; port NTC_Switch1, port NTC_Switch4, port NTC_Switch5
NetR12_2: U2.39(PC8) ; port NTC_Switch2
NetR14_2: U2.40(PC9) ; port NTC_Switch3
NetR42_2: U2.58(PB6) ; port ChargeCurrent_EN
NetR45_1: U2.38(PC7) ; port LEDButton
NetR61_1: U2.33(PB12) ; port SDA
NetR62_1: U2.30(PB11) ; port SCL
NetU2_29: U2.29(PB10) ; port PMON_Enable
NetU2_35: U2.35(PB14) ; port NRF_SWCLK
NetU2_36: U2.36(PB15) ; port NRF_SWDIO
NetU2_56: U2.56(PB4_(NJTRST)) ; port CAN_EN

Not connected (* = marked no-connect by the designer): U2 1(VBAT) 2(PC13)* 5(PH0-OSC_IN_(PH0))* 6(PH1-OSC_OUT_(PH1))* 15(PA1)* 37(PC6)* 41(PA8)* 50(PA15_(JTDI))* 54(PD2)* 59(PB7)*

### Notes on the sheet
- Title
- Size:
- Date:
- A3
- Number:
- Time:
- Revision:
- Sheet
- of
- File:

### Library data of the parts
C10 C11 = 18pF/0402/CER/50V: Capacitor, 18pF, 50V, NP0; Capacitance Tolerance: ± 5%; Capacitor Case Style: 0402; Brand Number: GRM1555C1H180JA01D; Brand: MURATA; Dielectric Characteristic: NP0; Capacitance: 18pF; Temperature Range: -55°C to 125°C; Price: 0,0177; Order Code Supplier: 1828876; Supplier: Farnell
C12-C20 = 100nF/0402/CER/25V: Capacitor, 100nF, 25V, X7R; Capacitance Tolerance: 10nF; Capacitor Case Style: 0402; Brand Number: GRM155R71E104KE14D; Brand: MULTICOMP; Dielectric Characteristic: X7R; Capacitance: 100nF; Temperature Range: -55 to +125 C; Price: 0,0225; Order Code Supplier: 2456106; Supplier: Farnell
R17 R18 = 10k/0402/0063W/50V: as R8 on sheet BatteryStackMonitor; Case Style: 0402; Order Code Supplier: 2121730; Price: 0,0005; Resistance: 10k; Supplier: Farnell; Temperature Coefficient: ± 100PPM; Temperature Range: -55°C to +125°C; Voltage Rating: 50V
U2 = STM32L476RCT6: Integrated Circuit; Manufacturer_Name: STMicroelectronics; Datasheet Link: https://www.st.com/resource/en/datasheet/stm32l476rc.pdf; Height: 1.6mm; Manufacturer_Part_Number: STM32L476RCT6; Mouser Part Number: 511-STM32L476RCT6; Mouser Price/Stock: https://www.mouser.co.uk/ProductDetail/STMicroelectronics/STM32L476RCT6?qs=kWQV1gtkNnc7gr%2FH8RnQ7w%3D%3D; Arrow Part Number: STM32L476RCT6; Arrow Price/Stock: https://www.arrow.com/en/products/stm32l476rct6/stmicroelectronics?region=nac
Y1 = ABS06-32.768KHZ-T: Crystal or Oscillator; Manufacturer_Name: ABRACON; Manufacturer_Part_Number: ABS05-32.768KHZ-9-T; Datasheet Link: https://abracon.com/Resonators/ABS05.pdf; Height: 0.5mm; Mouser Part Number: 815-ABS05-32.768K9T; Mouser Price/Stock: https://www.mouser.co.uk/ProductDetail/ABRACON/ABS05-32.768KHZ-9-T?qs=Pyu0ZBy%2FIJbsNYnIET1z3A%3D%3D; Arrow Part Number: ABS05-32.768KHZ-9-T; Arrow Price/Stock: https://www.arrow.com/en/products/abs05-32.768khz-9-t/abracon?region=nac

## Sheet PowerSwitch.SchDoc: Power switching
size A3; SheetNumber: 5; SheetTotal: 7
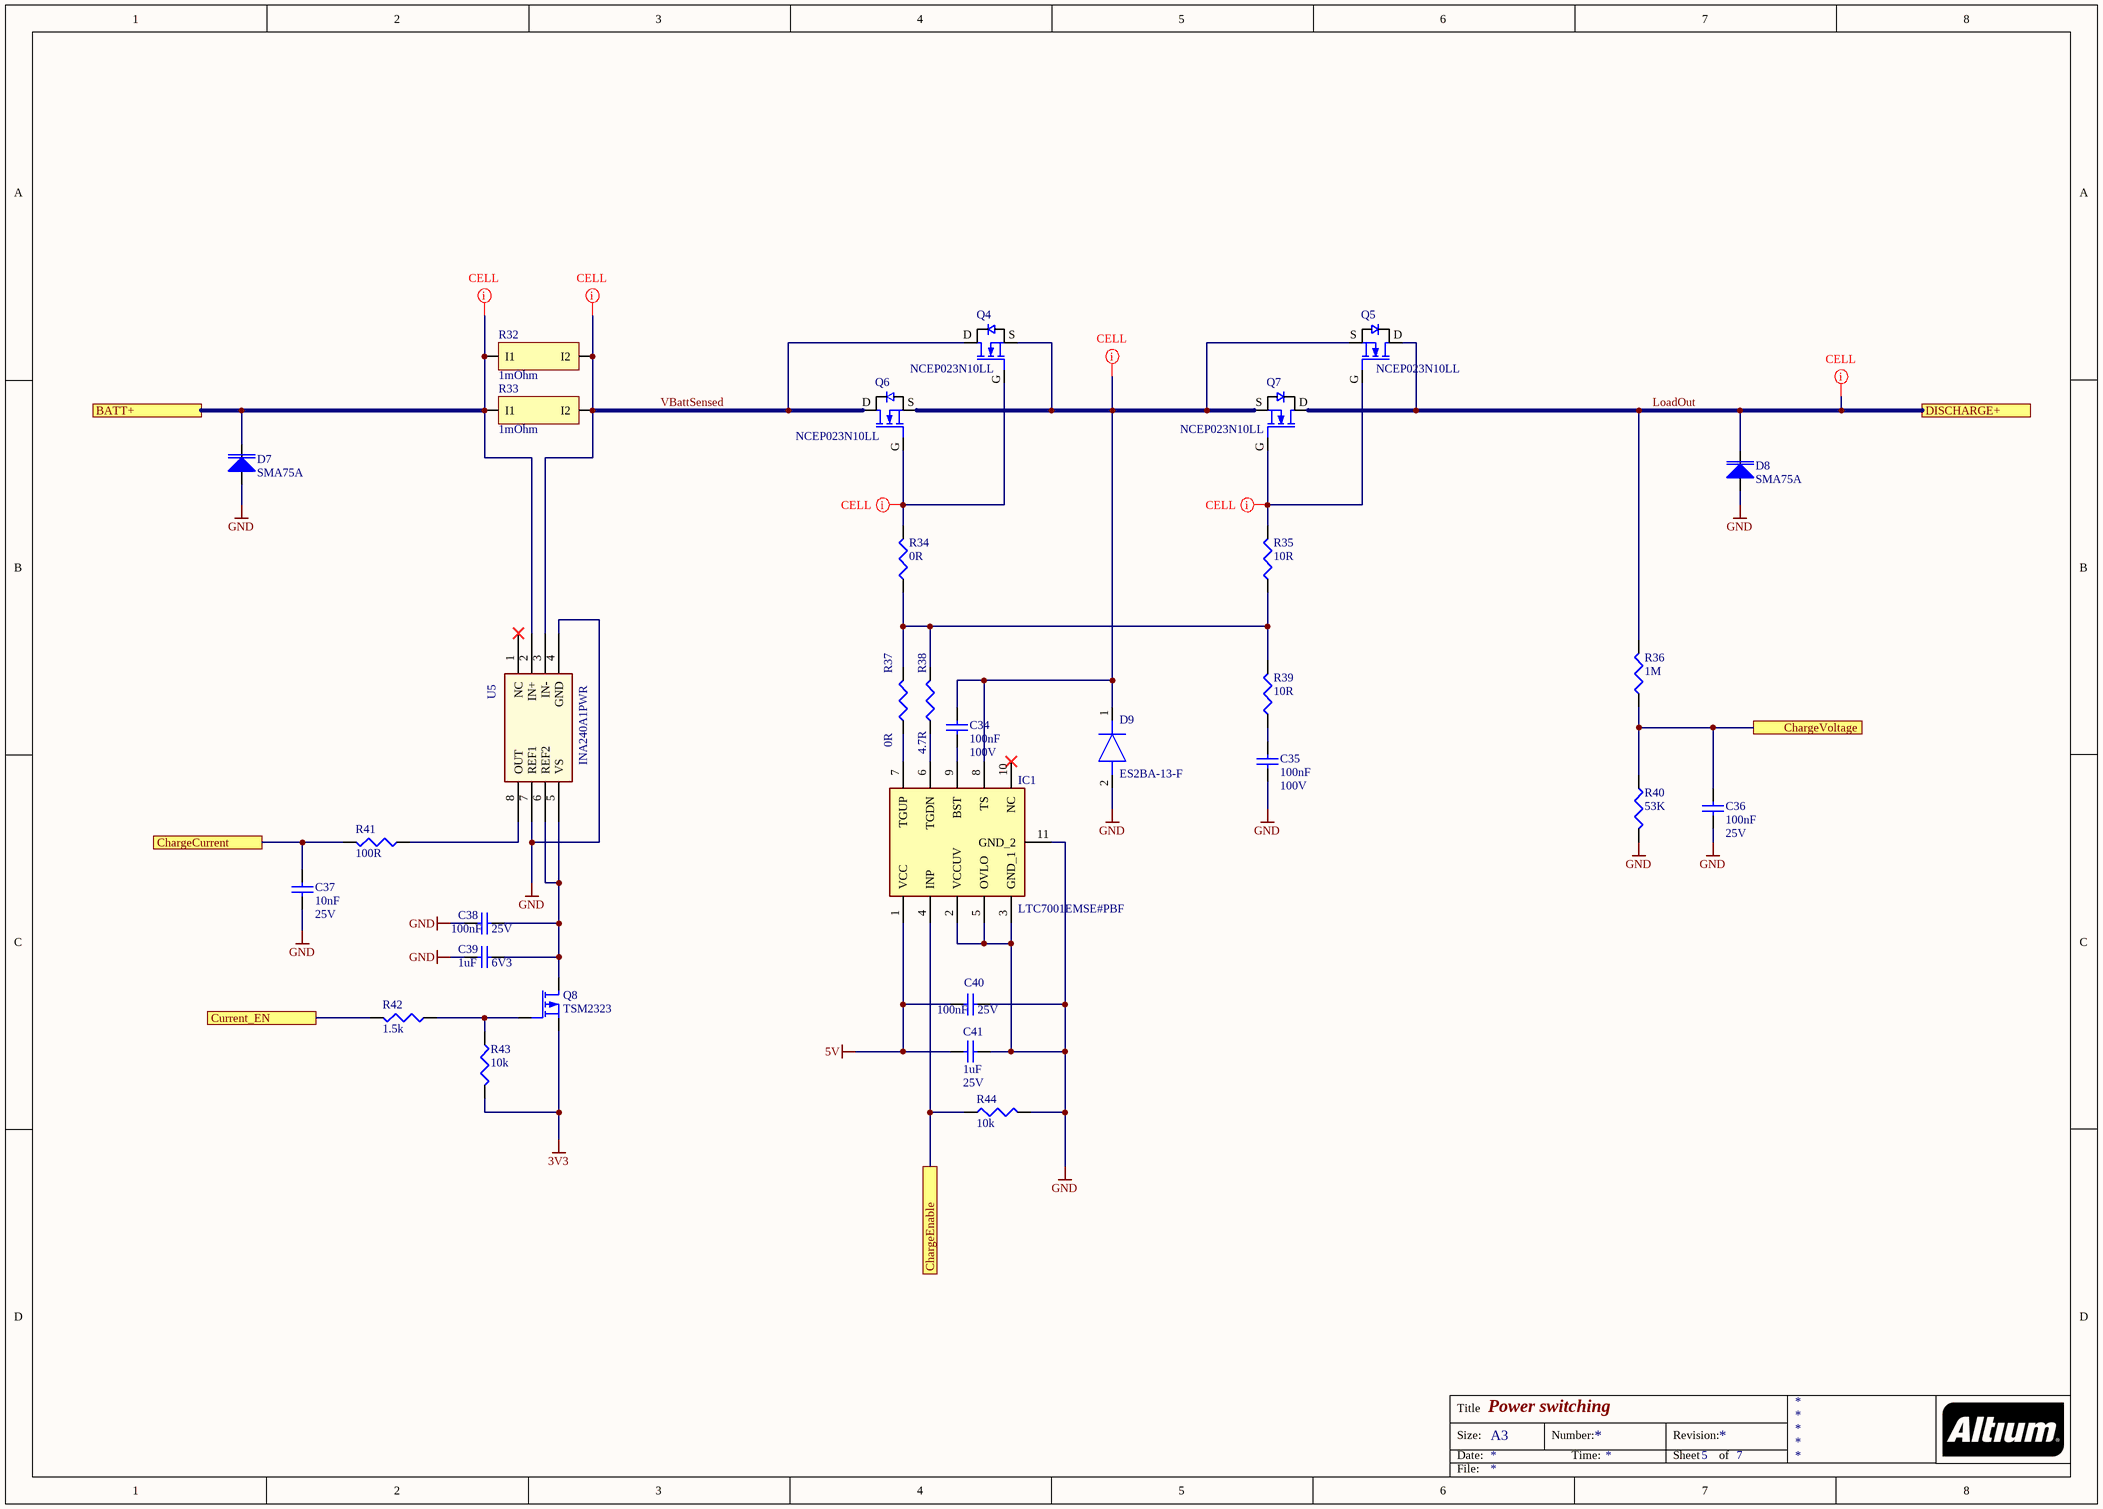
[diagram p4: PowerSwitch.SchDoc]

### Parts
C34  100nF  Voltage Rating: 100V  [C-1206]
C35  100nF  Voltage Rating: 100V  [C-1206]
C36  100nF  Voltage Rating: 25V  [C0402]
C37  10nF  Voltage Rating: 25V  [C0402]
C38  100nF  Voltage Rating: 25V  [C0402]
C39  1uF  Voltage Rating: 6V3  [C0402]
C40  100nF  Voltage Rating: 25V  [C0402]
C41  1uF  Voltage Rating: 25V  [C0402]
D7  SMA75A  [DIOM7959X262N]
D8  SMA75A  [DIOM7959X262N]
D9  ES2BA-13-F  [DIOM5226X230N]
IC1  LTC7001EMSE#PBF  [SOP50P490X110-11N]
Q4  NCEP023N10LL  [TOLL]
Q5  NCEP023N10LL  [TOLL]
Q6  NCEP023N10LL  [TOLL]
Q7  NCEP023N10LL  [TOLL]
Q8  TSM2323  [SOT-23]
R32  1mOhm  [RES-SMD_L10.0-W5.2]
R33  1mOhm  [RES-SMD_L10.0-W5.2]
R34  0R  [0603]
R35  10R  [0603]
R36  1M  [0402]
R37  0R  [0603]
R38  4.7R  [0603]
R39  10R  [0603]
R40  53K  [0402]
R41  100R  [0402]
R42  1.5k  [0402]
R43  10k  [0402]
R44  10k  [0402]
U5  INA240A1PWR  [TSSOP-8]

### Ports
BATT+, ChargeCurrent, ChargeEnable, ChargeVoltage, Current_EN, DISCHARGE+

### Nets
3V3: Q8.S R43.2
5V: C40.1 C41.2 IC1.1(VCC)
GND: C35.1 C36.1 C37.1 C38.1 C39.1 C40.2 C41.1 D7.1 D8.1 D9.2(A) IC1.2(VCCUV) IC1.3(GND_1) IC1.5(OVLO) IC1.11(GND_2) R40.2 R44.2 U5.4(GND) U5.7(REF1)
BATT+: D7.2 R32.0(I1) R33.0(I1) U5.2(IN+) ; port BATT+
ChargeEnable: IC1.4(INP) R44.1 ; port ChargeEnable
LoadOut: D8.2 Q5.D Q7.D R36.2 ; port DISCHARGE+
VBattSensed: Q4.D Q6.D R32.1(I2) R33.1(I2) U5.3(IN-)
NetC34_1: C34.1 IC1.9(BST)
NetC34_2: C34.2 D9.1(K) IC1.8(TS) Q4.S Q5.S Q6.S Q7.S
NetC35_2: C35.2 R39.1
NetC36_2: C36.2 R36.1 R40.1 ; port ChargeVoltage
NetC37_2: C37.2 R41.2 ; port ChargeCurrent
NetC38_2: C38.2 C39.2 Q8.D U5.5(VS) U5.6(REF2)
NetIC1_6: IC1.6(TGDN) R38.1
NetIC1_7: IC1.7(TGUP) R37.1
NetQ4_G: Q4.G Q6.G R34.2
NetQ5_G: Q5.G Q7.G R35.2
NetQ8_G: Q8.G R42.1 R43.1
NetR34_1: R34.1 R35.1 R37.2 R38.2 R39.2
NetR41_1: R41.1 U5.8(OUT)
NetR42_2: R42.2 ; port Current_EN

Not connected (* = marked no-connect by the designer): IC1 10(NC)*; U5 1(NC)*

### Layout directives
net class CELL: BATT+, LoadOut, NetC34_2, NetQ4_G, NetQ5_G, VBattSensed

### Notes on the sheet
- Title
- Size:
- Date:
- A3
- Number:
- Time:
- Revision:
- Sheet
- of
- File:

### Library data of the parts
C34 C35 = 1uF/1206/CER/100V: as C1 on sheet BatteryStackMonitor; Dielectric Characteristic: X7R; Capacitance: 1uF; Temperature Range: -55°C to +125°C; Price: 0,52; Order Code Supplier: 1833855; Supplier: Farnell
C36 C38 C40 C41 = 100nF/0402/CER/25V: as C12 on sheet Controller; Dielectric Characteristic: X7R; Capacitance: 100nF; Temperature Range: -55 to +125 C; Price: 0,0225; Order Code Supplier: 2456106; Supplier: Farnell
C37 = 100nF/0402/CER/25V: Capacitor, 100nF, 25V, X7R; Capacitor Case Style: 0402; Brand Number: GRM155R71E104KE14D; Brand: MULTICOMP; Dielectric Characteristic: X7R; Capacitance: 100nF; Capacitance Tolerance: 10nF; Temperature Range: -55 to +125 C; Price: 0,0225; Order Code Supplier: 2456106; Supplier: Farnell
C39 = 1uF/0402/CER/6.3V: as C2 on sheet BatteryStackMonitor; Dielectric Characteristic: X5R; Capacitance: 1uF; Temperature Range: -55°C to +85°C; Price: 0,0874; Order Code Supplier: 1327658; Supplier: Farnell
D7 D8 = SMA75A: Diode TVS, Vrwm: 75V, Vbr: 81.9V, Vc: 113V, Ippm: 27A; Brand: STMICROELECTRONICS; Brand Number: SMBJ70A-TR; Case Style: SMB; Vrwm: 70V; Breakdown Voltage: 81.9V; Clamping Voltage: 113V; Ippm: 27A; Order Code Supplier: 9886389; Price: 0,33; Supplier: Farnell; Temperature Range: -55°C to +150°C
D9 = ES2BA-13-F: Diode; Manufacturer_Name: Diodes Incorporated; Datasheet Link: https://www.diodes.com/assets/Datasheets/ds14002.pdf; Height: 2.3mm; Manufacturer_Part_Number: ES2BA-13-F; Mouser Part Number: 621-ES2BA-F; Mouser Price/Stock: https://www.mouser.co.uk/ProductDetail/Diodes-Incorporated/ES2BA-13-F?qs=VEnr2Ndo2sLuOIbJ1qj2iA%3D%3D; Arrow Part Number: ES2BA-13-F; Arrow Price/Stock: https://www.arrow.com/en/products/es2ba-13-f/diodes-incorporated?region=nac
IC1 = LTC7001EMSE#PBF: Integrated Circuit; Manufacturer_Name: Analog Devices; Datasheet Link: https://www.mouser.de/datasheet/2/609/LTC7001-1504282.pdf; Height: 1.1mm; Manufacturer_Part_Number: LTC7001EMSE#PBF; Mouser Part Number: 584-LTC7001EMSEPBF; Mouser Price/Stock: https://www.mouser.co.uk/ProductDetail/Analog-Devices/LTC7001EMSEPBF?qs=BZBei1rCqCDffAMQwGwGFw%3D%3D; Arrow Part Number: LTC7001EMSE#PBF; Arrow Price/Stock: https://www.arrow.com/en/products/ltc7001emsepbf/analog-devices?utm_currency=USD&region=nac
Q4-Q7 = NCEP023N10LL: Mosfet, N-channel, Vds:100V, Id:330A, Vgs-th:3.7V, Rds-on:0.00115ohm; Brand: INTERNATIONAL RECTIFIER; Brand Number: IRFS7530-7PPBF; Case Style: TO-263; Drain Current: 338A; Drain Source Voltage: 60V; Gate Source Voltage: 10V; Threshold Voltage: 3.7V; On Resistance: 0.00115ohm; Order Code Supplier: 2580027; Price: 4,40; Supplier: Farnell; Temperature Range: -55°C to +175°C; Transistor Polarity: N-Channel
Q8 = TSM2323: as Q9 on sheet BMS_TopLevel; Case Style: SOT-23; On Resistance: 0.039ohm; Order Code Supplier: 1864590; Price: 0,195; Supplier: Farnell; Temperature Range: -55°C to +150°C; Transistor Polarity: P-channel
R32 R33 = FCSL110R001JER: 1mohm, 5 W, ± 5%, 4320 Wide; Brand: Ohmite; Order Code Supplier: 2420535; Price: 3,81; Brand Number: FCSL110R001JER; Supplier: Farnell
R34 R35 R37-R39 = 100/0603/0063W/50V: as R58 on sheet BMS_CellNode; Case Style: 0603; Order Code Supplier: 2122239; Power Rating: 0.063W; Price: 0,007; Resistance: 100R; Supplier: Farnell; Temperature Coefficient: ± 200PPM; Temperature Range: -55°C to +125°C; Voltage Rating: 50V
R36 R40-R44 = 1.5k/0402/0063W/50V: as R46 on sheet BMS_TopLevel; Case Style: 0402; Order Code Supplier: 2121624; Price: 0,0054; Resistance: 1.5k; Supplier: Farnell; Temperature Coefficient: ± 100PPM; Temperature Range: -55°C to +125°C; Voltage Rating: 50V

## Sheet PowerManagement.SchDoc: Power management
size A4; SheetNumber: 4; SheetTotal: 7
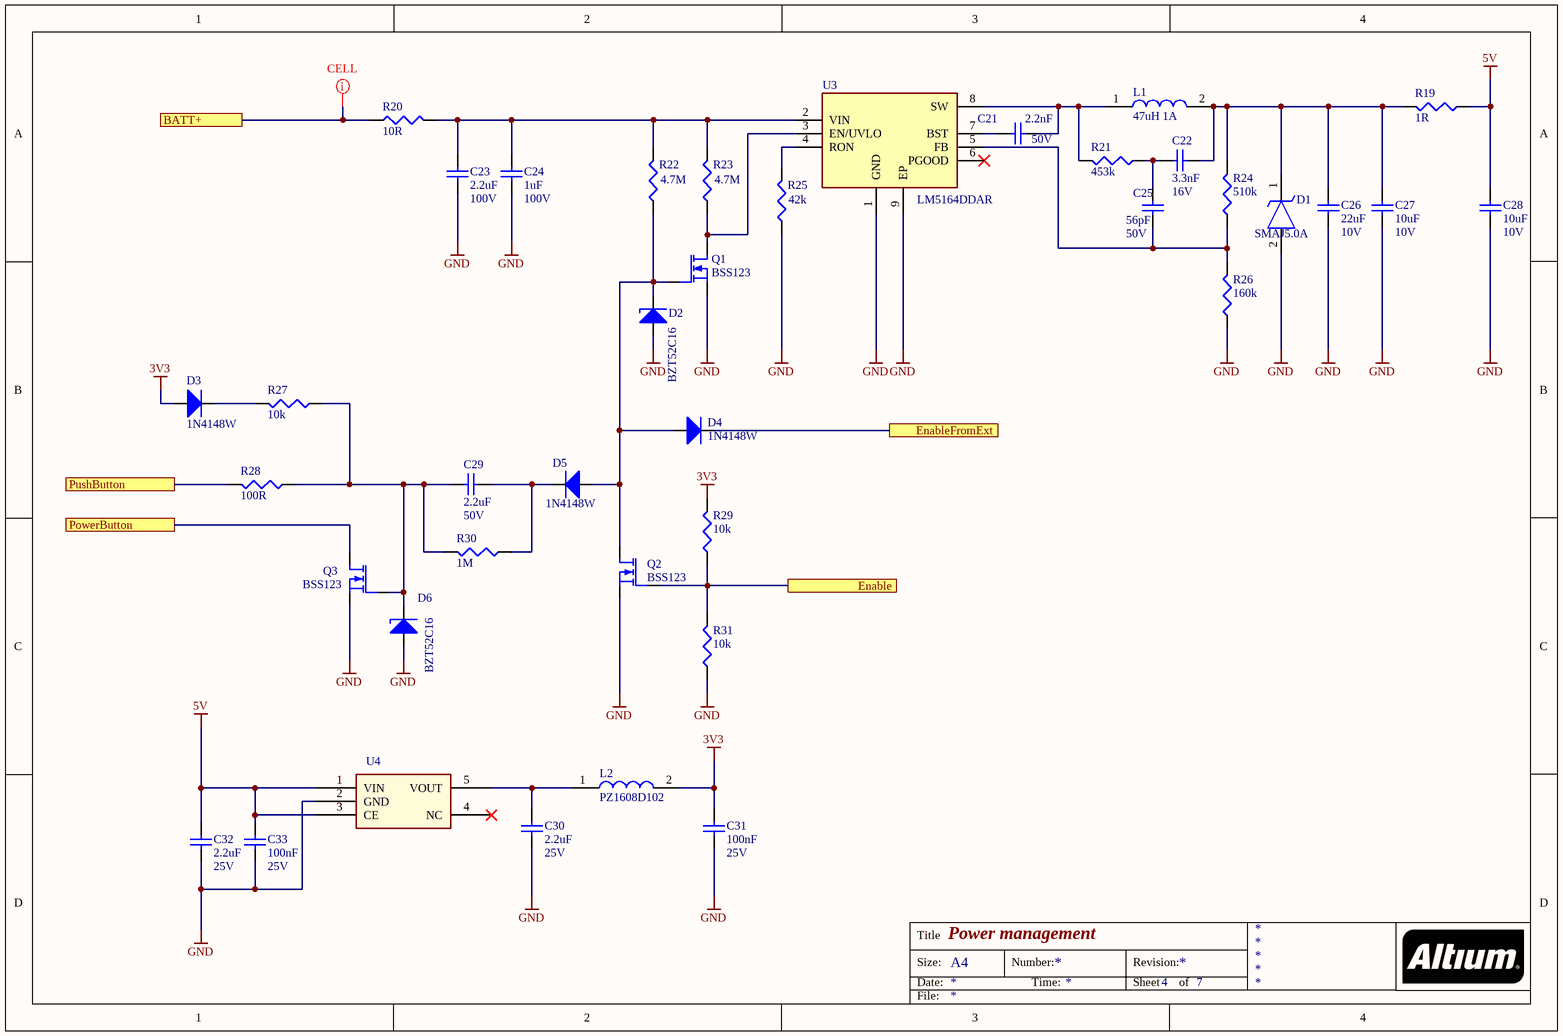
[diagram p5: PowerManagement.SchDoc]

### Parts
C21  2.2nF  Voltage Rating: 50V  [C0402]
C22  3.3nF  Voltage Rating: 16V  [C0402]
C23  2.2uF  Voltage Rating: 100V  [C-1206]
C24  1uF  Voltage Rating: 100V  [C-1206]
C25  56pF  Voltage Rating: 50V  [C0402]
C26  22uF  Voltage Rating: 10V  [C-0805]
C27  10uF  Voltage Rating: 10V  [C-0805]
C28  10uF  Voltage Rating: 10V  [C-0805]
C29  2.2uF  Voltage Rating: 50V  [C-0805]
C30  2.2uF  Voltage Rating: 25V  [C0402]
C31  100nF  Voltage Rating: 25V  [C0402]
C32  2.2uF  Voltage Rating: 25V  [C0402]
C33  100nF  Voltage Rating: 25V  [C0402]
D1  SMAJ5.0A  [SOD-123F]
D2  BZT52C16  [SOD123]
D3  1N4148W  [SOD123]
D4  1N4148W  [SOD123]
D5  1N4148W  [SOD123]
D6  BZT52C16  [SOD123]
L1  47uH 1A  [L5040]
L2  PZ1608D102  [L0603]
Q1  BSS123  [SOT-23]
Q2  BSS123  [SOT-23]
Q3  BSS123  [SOT-23]
R19  1R  [0805]
R20  10R  [R1206]
R21  453k  [0402]
R22  4.7M  [0402]
R23  4.7M  [0402]
R24  510k  [0402]
R25  42k  [0402]
R26  160k  [0402]
R27  10k  [0402]
R28  100R  [0603]
R29  10k  [0402]
R30  1M  [0402]
R31  10k  [0402]
U3  LM5164DDAR  [SOIC127P600X170-9N]
U4  XC6219B332MR  [SOT-23-5]  (value not drawn)

### Ports
BATT+, Enable, EnableFromExt, PowerButton, PushButton

### Nets
3V3: C31.1 D3.1(A) L2.2 R29.2
5V: C28.2 C32.1 C33.1 R19.1 U4.1(VIN) U4.3(CE)
GND: C23.1 C24.1 C26.1 C27.1 C28.1 C30.2 C31.2 C32.2 C33.2 D1.2(A) D2.1(A) D6.1(A) Q1.S Q2.S Q3.S R25.1 R26.1 R31.1 U3.1(GND) U3.9(EP) U4.2(GND)
BATT+: R20.1 ; port BATT+
PushButton: R28.2 ; port PushButton
NetC21_1: C21.1 U3.7(BST)
NetC21_2: C21.2 L1.1 R21.2 U3.8(SW)
NetC22_1: C22.1 C25.1 R21.1
NetC22_2: C22.2 C26.2 C27.2 D1.1(K) L1.2 R19.2 R24.2
NetC23_2: C23.2 C24.2 R20.2 R22.2 R23.2 U3.2(VIN)
NetC25_2: C25.2 R24.1 R26.2 U3.5(FB)
NetC29_1: C29.1 D6.2(K) Q3.G R27.2 R28.1 R30.2
NetC29_2: C29.2 D5.2(K) R30.1
NetC30_1: C30.1 L2.1 U4.5(VOUT)
NetD2_2: D2.2(K) D4.1(A) D5.1(A) Q1.G Q2.D R22.1
NetD3_2: D3.2(K) R27.1
NetD4_2: D4.2(K) ; port EnableFromExt
NetQ1_D: Q1.D R23.1 U3.3(EN/UVLO)
NetQ2_G: Q2.G R29.1 R31.2 ; port Enable
NetQ3_D: Q3.D ; port PowerButton
NetR25_2: R25.2 U3.4(RON)

Not connected (* = marked no-connect by the designer): U3 6(PGOOD)*; U4 4(NC)*

### Layout directives
net class CELL: BATT+

### Notes on the sheet
- Title
- Size:
- Date:
- A4
- Number:
- Time:
- Revision:
- Sheet
- of
- File:

### Library data of the parts
C21 C22 C25 C30-C33 = 100nF/0402/CER/25V: as C12 on sheet Controller; Dielectric Characteristic: X7R; Capacitance: 100nF; Temperature Range: -55 to +125 C; Price: 0,0225; Order Code Supplier: 2456106; Supplier: Farnell
C23 C24 = 1uF/1206/CER/100V: as C1 on sheet BatteryStackMonitor; Dielectric Characteristic: X7R; Capacitance: 1uF; Temperature Range: -55°C to +125°C; Price: 0,52; Order Code Supplier: 1833855; Supplier: Farnell
C26-C28 = 10uF/0805/CER/10V: Capacitor, 10uF, 10V, X7R; Capacitance Tolerance: ± 10%; Capacitor Case Style: 0805; Brand Number: GRM21BR71A106KE51L; Brand: MURATA; Dielectric Characteristic: X7R; Capacitance: 10uF; Temperature Range: -55°C to +125°C; Price: 0,36; Order Code Supplier: 1828828; Supplier: Farnell
C29 = 2.2uF/0805/CER/50V: Capacitor, 2.2uF, 50V,  X7R; Dielectric Characteristic: X5R; Capacitance Tolerance: ± 10%; Capacitor Case Style: 0805; Brand Number: GRM219R61H225KE15D; Brand: MURATA; Capacitance: 2.2uF; Temperature Range: -55°C to +125°C; Price: 0,113; Order Code Supplier: 2611933; Supplier: Farnell
D1 = SMAJ5.0A: TVS Diode (Uni-directional); Manufacturer_Name: LITTELFUSE; Manufacturer_Part_Number: SMAJ7.0A; Datasheet Link: https://www.littelfuse.com/media?resourcetype=datasheets&itemid=75e32973-b177-4ee3-a0ff-cedaf1abdb93&filename=smaj-datasheet; Height: 2.29mm; Mouser Part Number: 576-SMAJ7.0A; Mouser Price/Stock: https://www.mouser.co.uk/ProductDetail/Littelfuse/SMAJ7.0A?qs=zHiv0nsVGmqwPZkMuKJUUw%3D%3D; Arrow Part Number: SMAJ7.0A; Arrow Price/Stock: https://www.arrow.com/en/products/smaj7.0a/littelfuse?region=europe
D2 D6 = BZT52C16: Diode Zener, Vz: 16V, If: 0.1A, Vf: 0.9V; Brand: Diodes; Case Style: SOD-123; Brand Number: BZT52C16; Forward Current: 0.1A; Forward Voltage: 0.9V; Order Code Supplier: 1902431; Price: 0,087; Supplier: Farnell; Temperature Range: -65°C to +150°C; Zener Voltage: 16V
D3-D5 = MMSD4148T1G: Diode, Vrrm: 100V, If: 0.15A, Vf: 1V; Brand: ON SEMICONDUCTOR; Case Style: SOD-123; Forward Current: 0.2A; Price: 0,19; Brand Number: MMSD4148T1G; Order Code Supplier: 9556079; Supplier: Farnell; Temperature Range: -65°C to +150°C; Vrrm: 100V; Forward Voltage: 1V
L1 = 74404054221: Inductor; Manufacturer_Name: Wurth Elektronik; Datasheet Link: https://www.mouser.com/datasheet/2/445/74404054221-1280555.pdf; Height: 4mm; Manufacturer_Part_Number: 74404054221; Mouser Part Number: 710-74404054221; Mouser Price/Stock: https://www.mouser.co.uk/ProductDetail/Wurth-Elektronik/74404054221?qs=f9yNj16SXrLBSuRgk86STQ%3D%3D
L2 = PZ1608D102: Inductor; Manufacturer_Name: Murata Electronics; Manufacturer_Part_Number: LQG15HS4N7C02D; Datasheet Link: https://search.murata.co.jp/Ceramy/image/img/P02/JELF243B-0010.pdf; Height: 0.6mm; Mouser Part Number: 81-LQG15HS4N7C02D; Mouser Price/Stock: https://www.mouser.co.uk/ProductDetail/Murata-Electronics/LQG15HS4N7C02D?qs=60uY6ySkanQsgm4t8ngjFA%3D%3D; Arrow Part Number: LQG15HS4N7C02D; Arrow Price/Stock: https://www.arrow.com/en/products/lqg15hs4n7c02d/murata-manufacturing
Q1-Q3 = BSS123: as Q10 on sheet BMS_TopLevel; Brand Number: BSS123; Case Style: SOT-23; Order Code Supplier: 1510764; Price: 0,082; Supplier: Farnell; Temperature Range: -55°C to +150°C; Transistor Polarity: N-channel
R19 = 1/0805/0250W/150V: Resistor, 1R, 1%, 0.25W, 150V, 200PPM, 0805; Brand: PANASONIC; Brand Number: ERJ6BQF1R0V; Case Style: 0805; Order Code Supplier: 1717826; Power Rating: 0.25W; Price: 0,28; Resistance: 1R; Supplier: Farnell; Temperature Coefficient: ± 200PPM; Temperature Range: -55°C to +125°C; Voltage Rating: 150V
R20 = RQ73C2B10RBTDF: as R1 on sheet BatteryStackMonitor; Datasheet Link: https://www.te.com/commerce/DocumentDelivery/DDEController?Action=showdoc&DocId=Data+Sheet%7F1773270-2%7FB%7Fpdf%7FEnglish%7FENG_DS_1773270-2_B.pdf%7F2176383-1; Height: 0.65mm; Manufacturer_Part_Number: RQ73C2B10RBTDF
R21-R26 R30 = 1M/0402/0063W/50V: as R2 on sheet BatteryStackMonitor; Case Style: 0402; Order Code Supplier: 2121984; Price: 0,0006; Resistance: 1M; Supplier: Farnell; Temperature Coefficient: ± 100PPM; Temperature Range: -55°C to +125°C; Voltage Rating: 50V
R27 R29 R31 = 10k/0402/0063W/50V: as R8 on sheet BatteryStackMonitor; Case Style: 0402; Order Code Supplier: 2121730; Price: 0,0005; Resistance: 10k; Supplier: Farnell; Temperature Coefficient: ± 100PPM; Temperature Range: -55°C to +125°C; Voltage Rating: 50V
R28 = 100/0603/0063W/50V: as R58 on sheet BMS_CellNode; Case Style: 0603; Order Code Supplier: 2122239; Power Rating: 0.063W; Price: 0,007; Resistance: 100R; Supplier: Farnell; Temperature Coefficient: ± 200PPM; Temperature Range: -55°C to +125°C; Voltage Rating: 50V
U3 = LM5164DDAR: Integrated Circuit; Manufacturer_Name: Texas Instruments; Datasheet Link: http://www.ti.com/lit/ds/symlink/lm5164.pdf; Height: 1.7mm; Manufacturer_Part_Number: LM5164DDAR; Mouser Part Number: 595-LM5164DDAR; Mouser Price/Stock: https://www.mouser.co.uk/ProductDetail/Texas-Instruments/LM5164DDAR?qs=PqoDHHvF64%2F0M%252BK9zcb2mw%3D%3D; Arrow Part Number: LM5164DDAR; Arrow Price/Stock: https://www.arrow.com/en/products/lm5164ddar/texas-instruments?utm_currency=USD&region=nac

## Sheet CAN.SchDoc: CAN interface
size A4; SheetNumber: 6; SheetTotal: 7
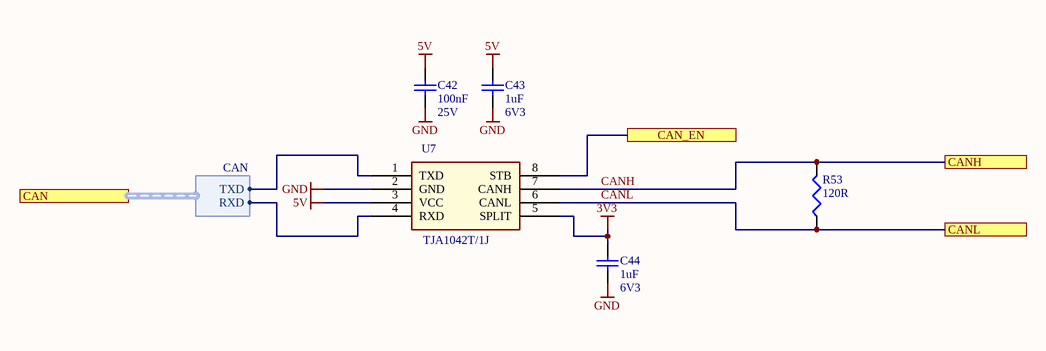
[diagram p6: CAN.SchDoc]

### Parts
C42  100nF  Voltage Rating: 25V  [C0402]
C43  1uF  Voltage Rating: 6V3  [C0402]
C44  1uF  Voltage Rating: 6V3  [C0402]
R53  120R  [0805]
U7  TJA1042T/1J  [SOP-8]

### Ports
CAN (harness CAN), CAN_EN, CANH, CANL

### Harnesses
CAN: RXD, TXD

### Nets
3V3: C44.2 U7.5(SPLIT)
5V: C42.2 C43.2 U7.3(VCC)
GND: C42.1 C43.1 C44.1 U7.2(GND)
CAN_RX: U7.4(RXD) ; port CAN.RXD
CAN_TX: U7.1(TXD) ; port CAN.TXD
CANH: R53.2 U7.7(CANH) ; port CANH
CANL: R53.1 U7.6(CANL) ; port CANL
NetU2_56: U7.8(STB) ; port CAN_EN

### Notes on the sheet
- Title
- Size:
- Date:
- A4
- Number:
- Time:
- Revision:
- Sheet
- of
- File:

### Library data of the parts
C42 = 100nF/0402/CER/25V: as C12 on sheet Controller; Dielectric Characteristic: X7R; Capacitance: 100nF; Temperature Range: -55 to +125 C; Price: 0,0225; Order Code Supplier: 2456106; Supplier: Farnell
C43 C44 = 1uF/0402/CER/6.3V: as C2 on sheet BatteryStackMonitor; Dielectric Characteristic: X5R; Capacitance: 1uF; Temperature Range: -55°C to +85°C; Price: 0,0874; Order Code Supplier: 1327658; Supplier: Farnell
R53 = 0/0805/0100W/150V_1: Resistor, 0R, 0.1%, 0.1W, 150V, 200PPM, 0805; Brand: MULTICOMP; Brand Number: MC 0.1W 0805 0R; Case Style: 0805; Order Code Supplier: 9333681; Power Rating: 0.1W; Price: 0,038; Resistance: 0R; Supplier: Farnell; Temperature Coefficient: ± 200PPM; Temperature Range: -55°C to +125°C; Voltage Rating: 150V

## Sheet USBSerial.SchDoc: USB Serial interface
size A4; SheetNumber: 7; SheetTotal: 7
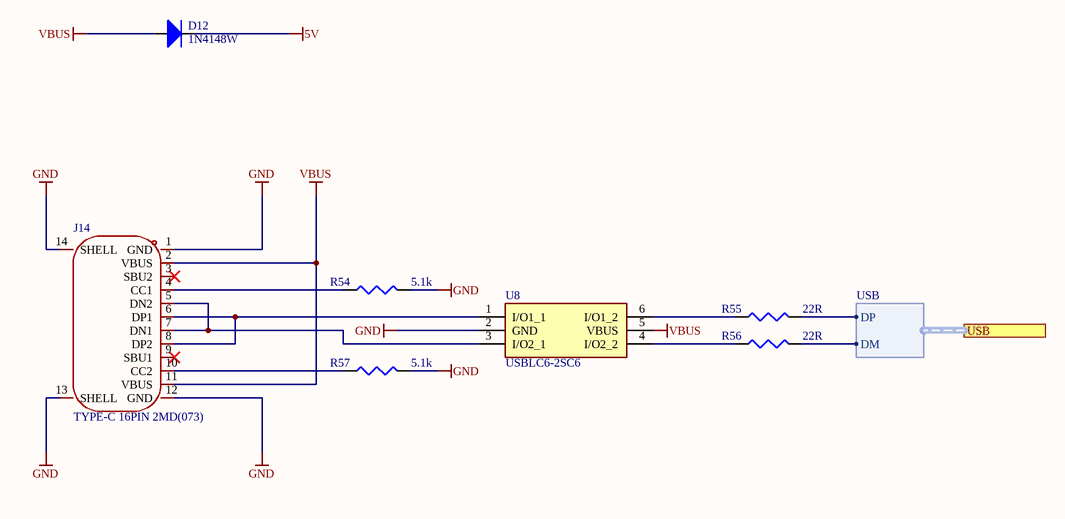
[diagram p7: USBSerial.SchDoc]

### Parts
D12  1N4148W  [SOD123]
J14  TYPE-C 16PIN 2MD(073)  [USB-C-SMD_TYPE-C-6PIN-2MD-073]
R54  5.1k  [0402]
R55  22R  [0402]
R56  22R  [0402]
R57  5.1k  [0402]
U8  USBLC6-2SC6  [SOT95P280X145-6N]

### Ports
USB (harness USB)

### Harnesses
USB: DM, DP

### Nets
5V: D12.2(K)
GND: J14.1(GND) J14.12(GND) J14.13(SHELL) J14.14(SHELL) R54.2 R57.2 U8.2(GND)
VBUS: D12.1(A) J14.2(VBUS) J14.11(VBUS) U8.5(VBUS)
USB_DM: R56.2 ; port USB.DM
USB_DP: R55.2 ; port USB.DP
NetJ14_4: J14.4(CC1) R54.1
NetJ14_5: J14.5(DN2) J14.7(DN1) U8.3(I/O2_1)
NetJ14_6: J14.6(DP1) J14.8(DP2) U8.1(I/O1_1)
NetJ14_10: J14.10(CC2) R57.1
NetR55_1: R55.1 U8.6(I/O1_2)
NetR56_1: R56.1 U8.4(I/O2_2)

Not connected (* = marked no-connect by the designer): J14 3(SBU2)* 9(SBU1)*

### Notes on the sheet
- Title
- Size:
- Date:
- A4
- Number:
- Time:
- Revision:
- Sheet
- of
- File:

### Library data of the parts
D12 = MMSD4148T1G: as D3 on sheet PowerManagement; Price: 0,19; Brand Number: MMSD4148T1G; Order Code Supplier: 9556079; Supplier: Farnell; Temperature Range: -65°C to +150°C; Vrrm: 100V; Forward Voltage: 1V
J14 = TYPE-C 16PIN 2MD(073): Manufacturer: SHOU HAN(首韩); Add into BOM: yes; Gender: 母; Number of Contacts: 16P; Number of Ports: 1; Current Rating - Power (Max): 5A; Rated Voltage (Max): 5V; Connect-Disconnect Life: 5千次; Core Colour: 黑色; Symbol: TYPE-C 16PIN 2MD(073); Device: TYPE-C 16PIN 2MD(073); LCSC Part Name: Type-C 母 卧贴; Supplier Part: C2765186; Manufacturer Part: TYPE-C 16PIN 2MD(073); Supplier Footprint: SMD; Datasheet: https://atta.szlcsc.com/upload/public/pdf/source/20211123/39B17C16241EAC15C5E277BDA434118E.pdf; Supplier: LCSC; Convert to PCB: yes; Connector Type: Type-C; Standard: USB 3.1; Mounting Style: 卧贴; Operating Temperature Range: -25℃~+85℃
R54-R57 = 240/0402/0063W/50V: Resistor, 240, 0.1%, 0.0625W, 50V, 100PPM, 0402; Brand: VISHAY DRALORIC; Brand Number: CRCW0402240RFKED; Power Rating: 0.063W; Resistance: 240; Case Style: 0402; Order Code Supplier: 2121522; Price: 0,0006; Supplier: Farnell; Temperature Coefficient: ± 100PPM; Temperature Range: -55°C to +125°C; Voltage Rating: 50V
U8 = USBLC6-2SC6: Integrated Circuit; Manufacturer_Name: STMicroelectronics; Datasheet Link: http://www.st.com/st-web-ui/static/active/en/resource/technical/document/datasheet/CD00050750.pdf; Height: 1.45mm; Manufacturer_Part_Number: USBLC6-2SC6; Mouser Part Number: 511-USBLC6-2SC6; Mouser Price/Stock: https://www.mouser.co.uk/ProductDetail/STMicroelectronics/USBLC6-2SC6?qs=po45yt2pPpu%2FhNIlwQdTlg%3D%3D; Arrow Part Number: USBLC6-2SC6; Arrow Price/Stock: https://www.arrow.com/en/products/usblc6-2sc6/stmicroelectronics?utm_currency=USD&region=europe

## Sheet HDC1080.SchDoc
size A4
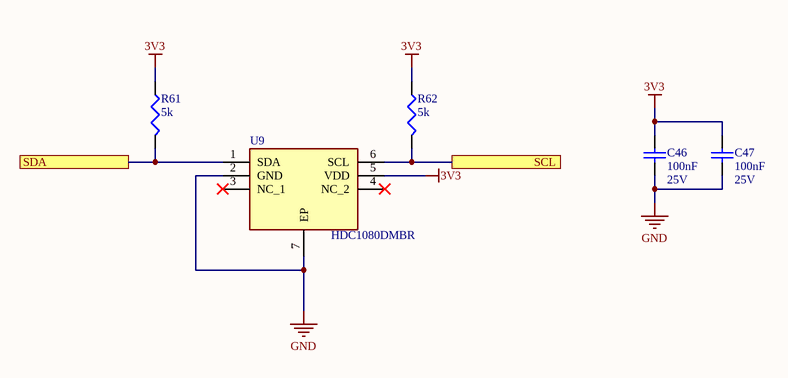
[diagram p8: HDC1080.SchDoc]

### Parts
C46  100nF  Voltage Rating: 25V  [C0402]
C47  100nF  Voltage Rating: 25V  [C0402]
R61  5k  [0402]
R62  5k  [0402]
U9  HDC1080DMBR  [SON100P300X300X80-7N-D]

### Ports
SCL, SDA

### Nets
3V3: C46.2 C47.2 R61.2 R62.2 U9.5(VDD)
GND: C46.1 C47.1 U9.2(GND) U9.7(EP)
NetR61_1: R61.1 U9.1(SDA) ; port SDA
NetR62_1: R62.1 U9.6(SCL) ; port SCL

Not connected (* = marked no-connect by the designer): U9 3(NC_1)* 4(NC_2)*

### Library data of the parts
C46 C47 = 100nF/0402/CER/25V: as C12 on sheet Controller; Dielectric Characteristic: X7R; Capacitance: 100nF; Temperature Range: -55 to +125 C; Price: 0,0225; Order Code Supplier: 2456106; Supplier: Farnell
R61 R62 = 10k/0402/0063W/50V: as R8 on sheet BatteryStackMonitor; Case Style: 0402; Order Code Supplier: 2121730; Price: 0,0005; Resistance: 10k; Supplier: Farnell; Temperature Coefficient: ± 100PPM; Temperature Range: -55°C to +125°C; Voltage Rating: 50V
U9 = HDC1080DMBR: Integrated Circuit; Manufacturer_Name: Texas Instruments; Datasheet Link: http://www.ti.com/lit/gpn/HDC1080; Height: 0.8mm; Manufacturer_Part_Number: HDC1080DMBR; Mouser Part Number: 595-HDC1080DMBR; Mouser Price/Stock: https://www.mouser.co.uk/ProductDetail/Texas-Instruments/HDC1080DMBR?qs=8%2FmU9qzJpL9OuhPLRSO9Vg%3D%3D; Arrow Part Number: HDC1080DMBR; Arrow Price/Stock: https://www.arrow.com/en/products/hdc1080dmbr/texas-instruments?region=nac